# Altium project PCB_Project_CAN_DEV.PrjPcb
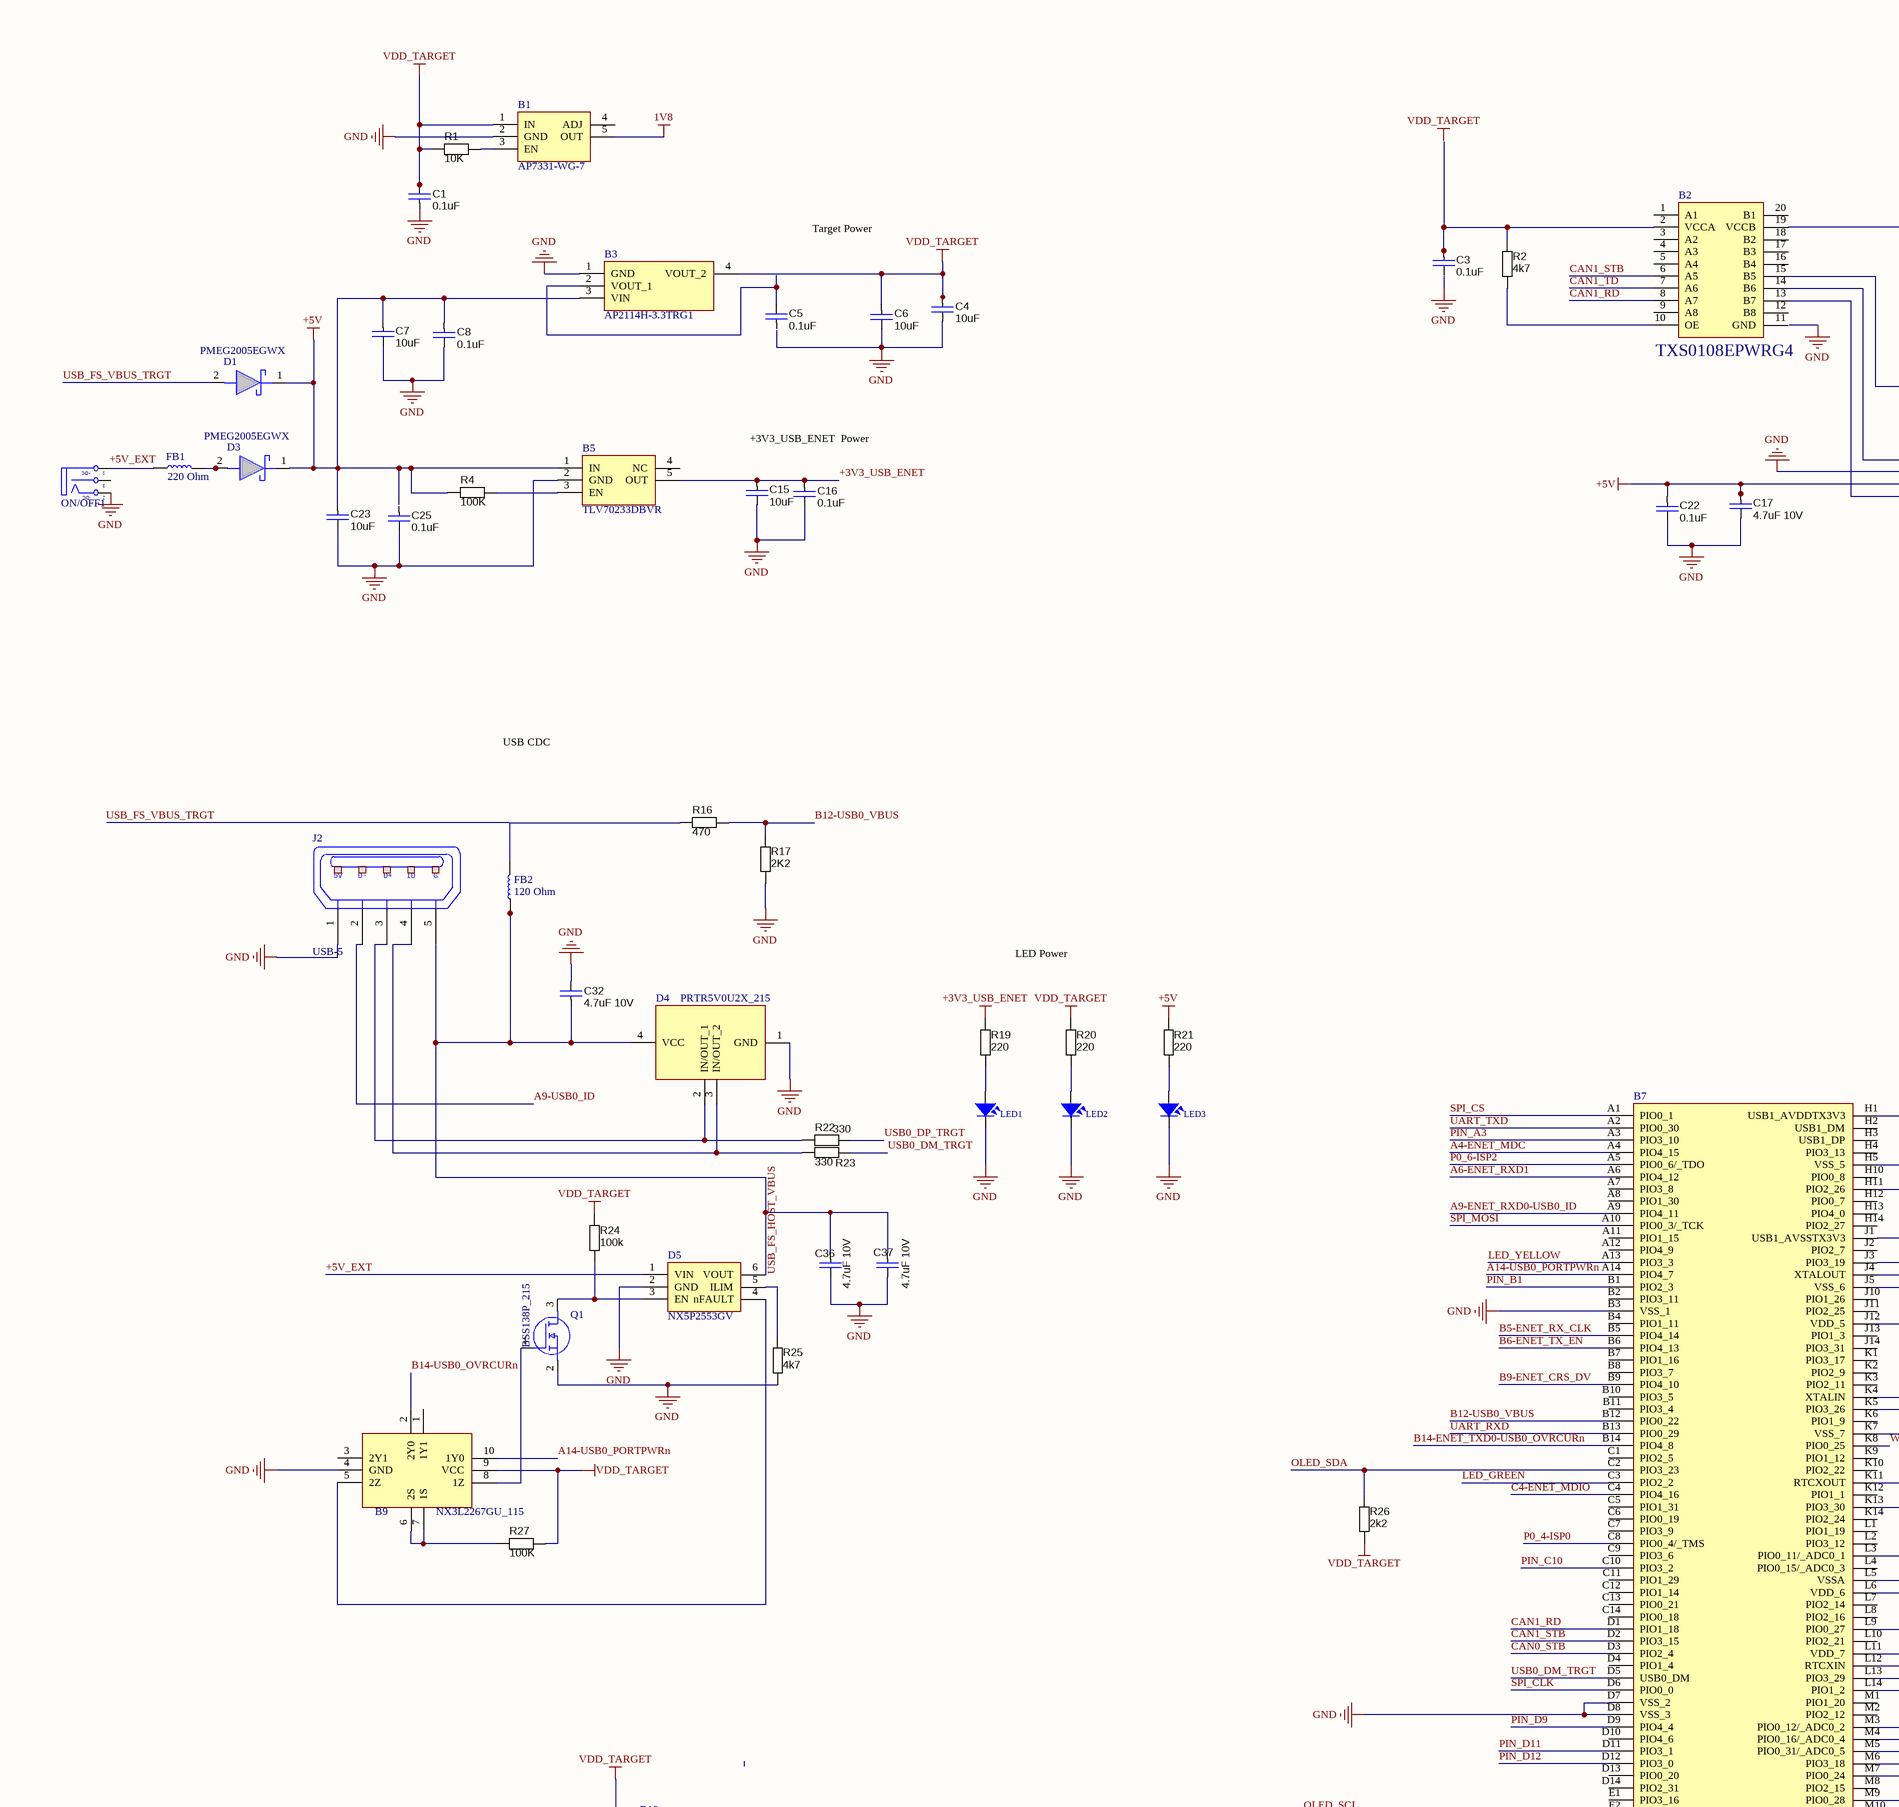
[diagram p0: CAN_DEVELOP.SchDoc, top left]
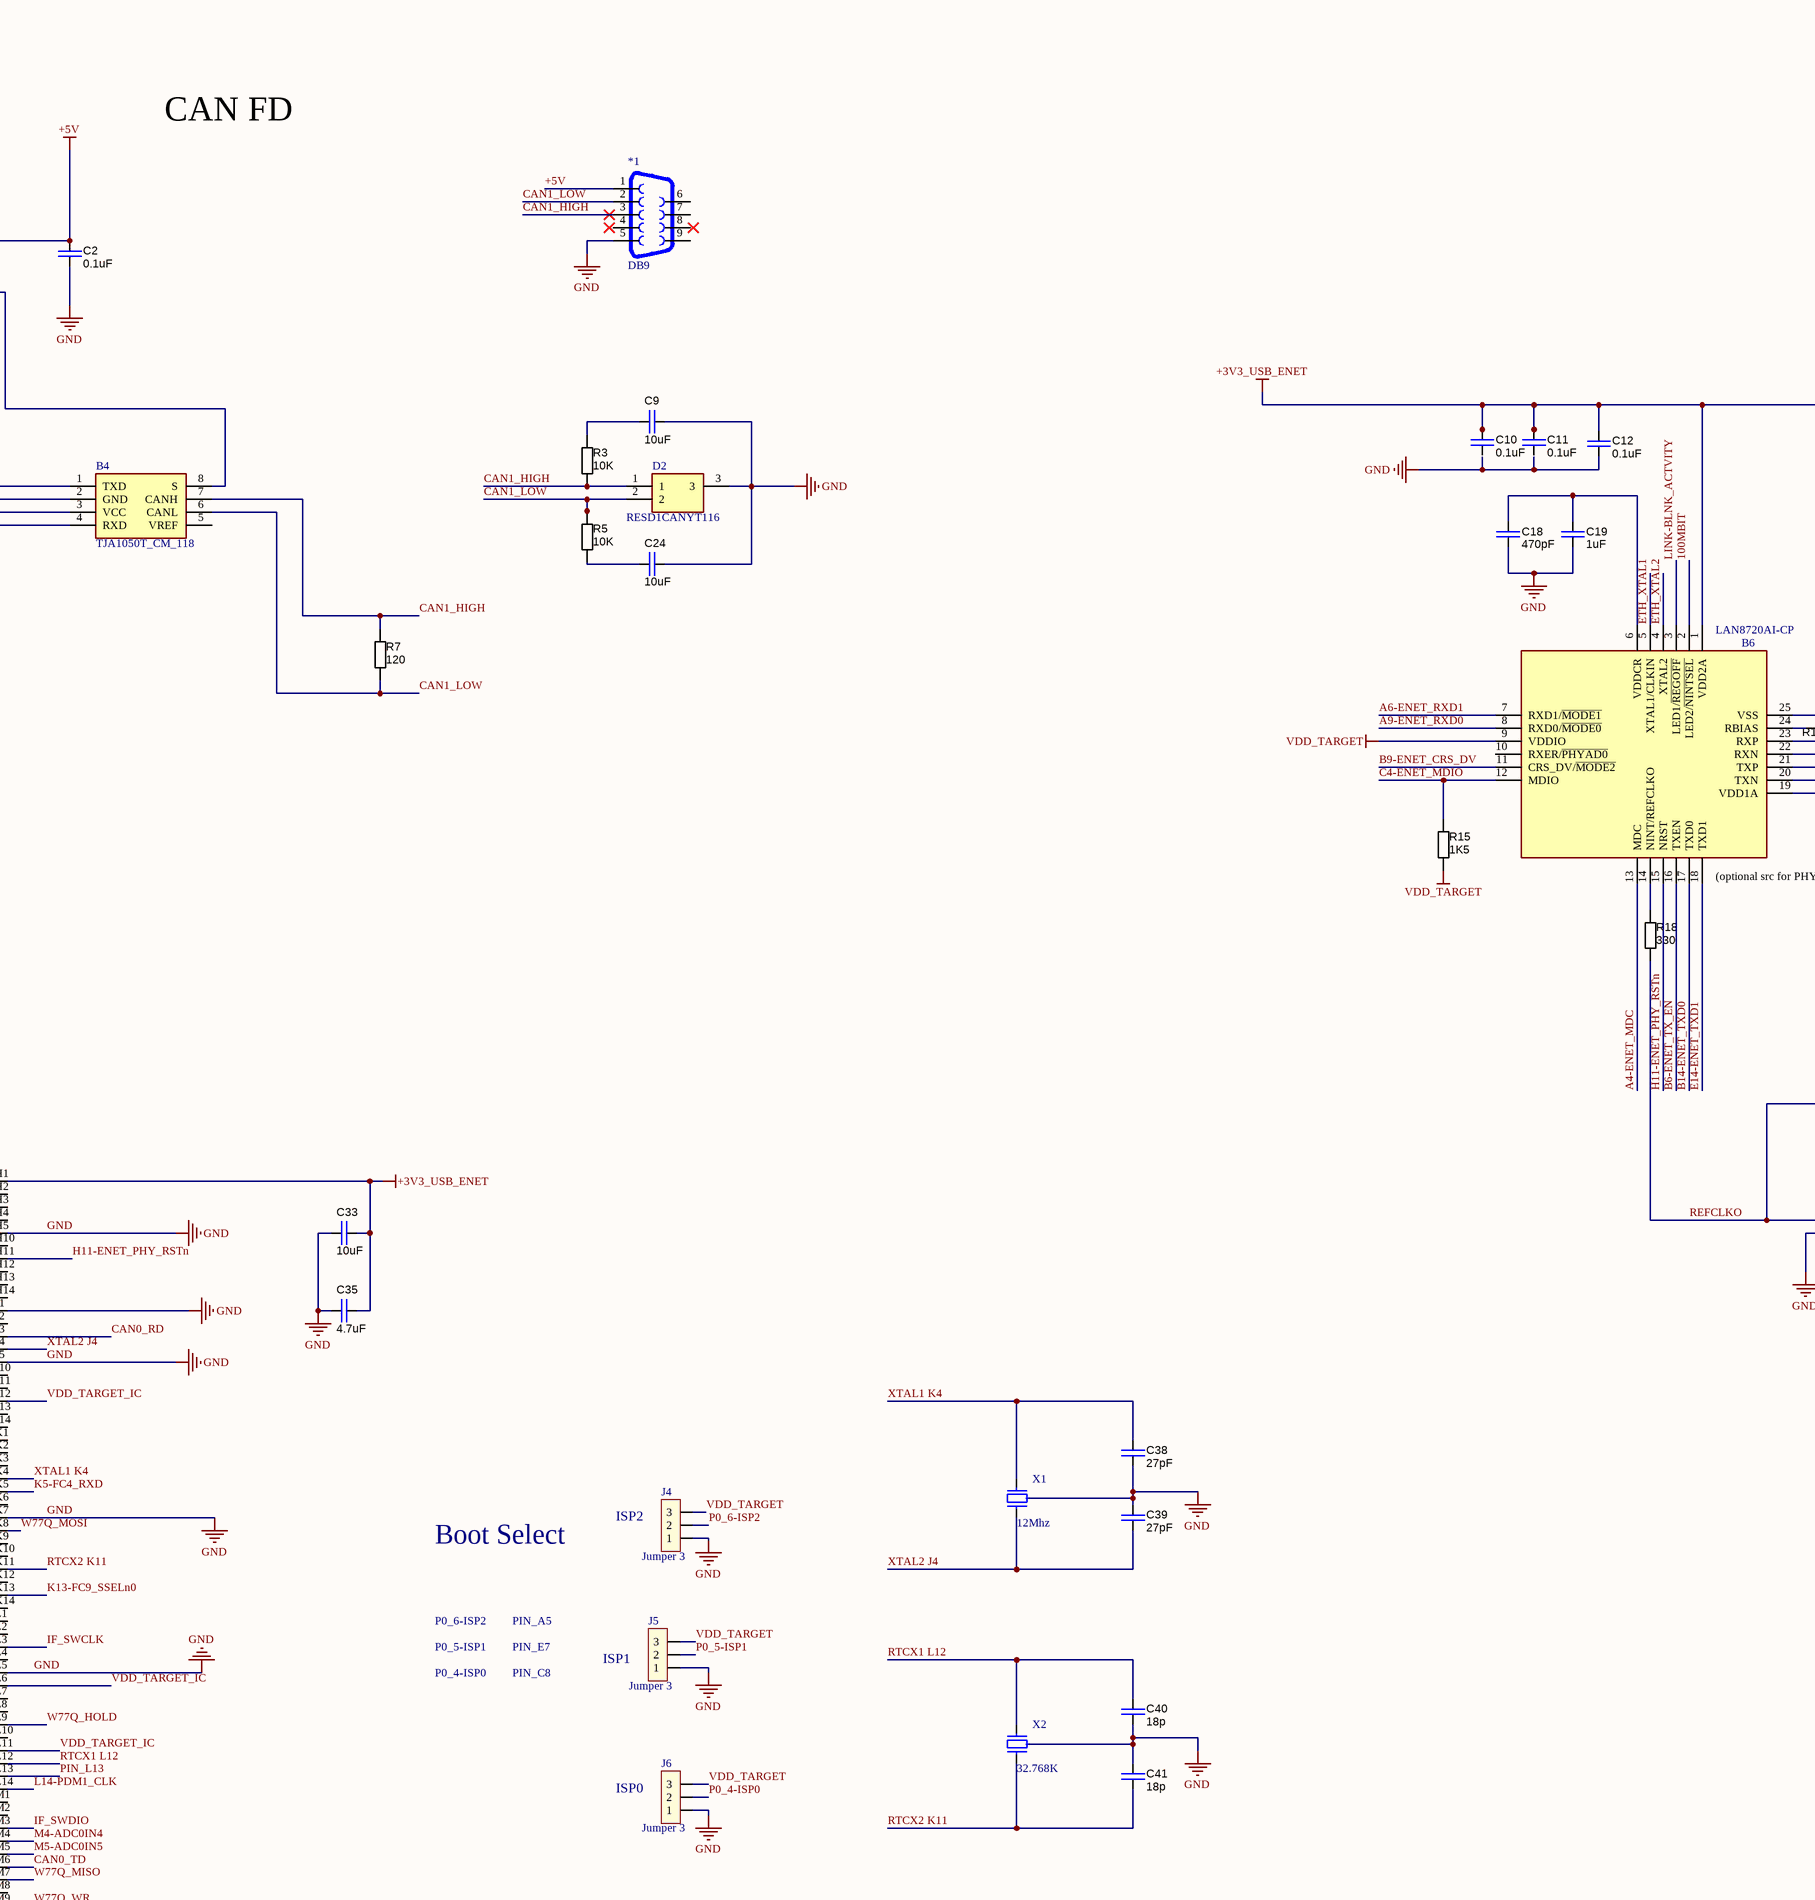
[diagram p1: CAN_DEVELOP.SchDoc, top middle]
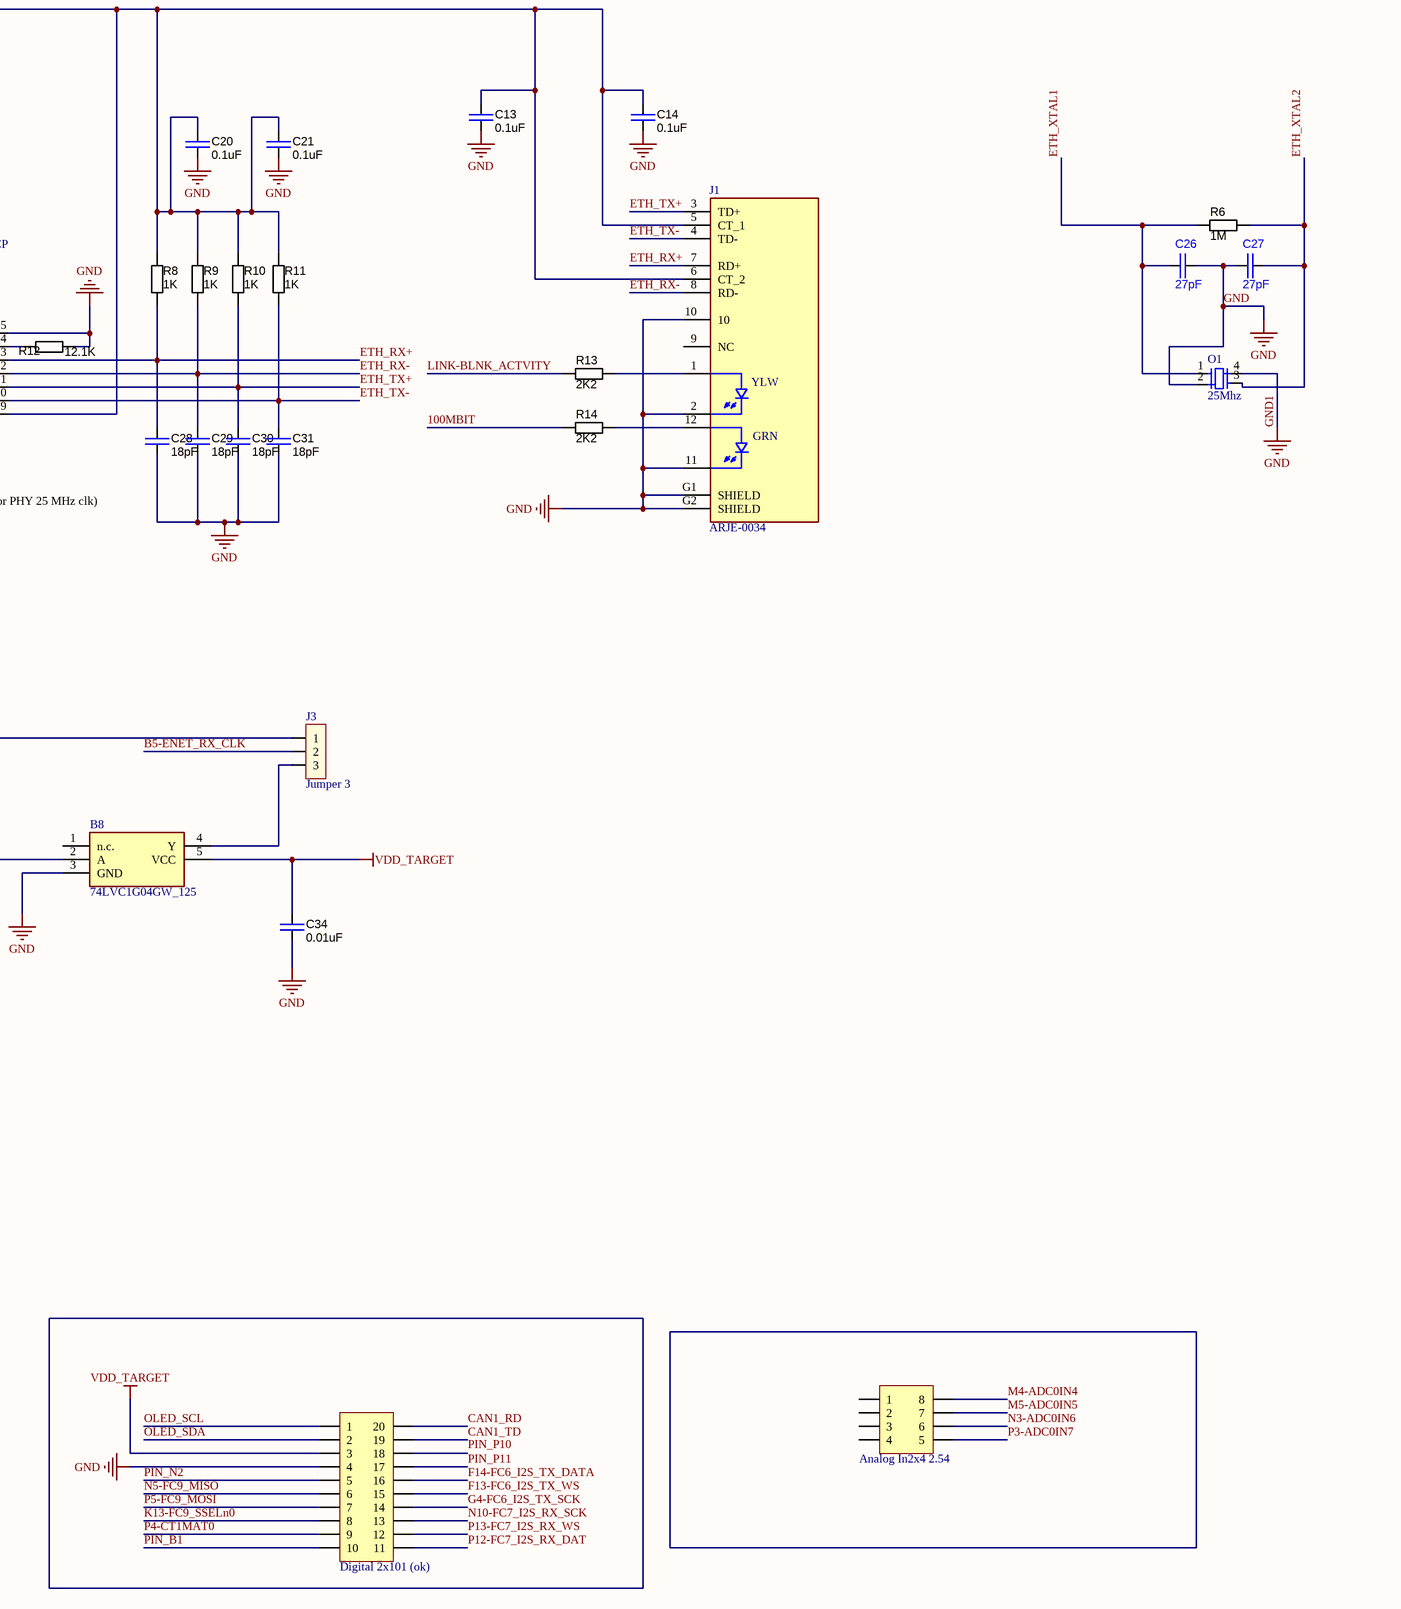
[diagram p2: CAN_DEVELOP.SchDoc, top right]
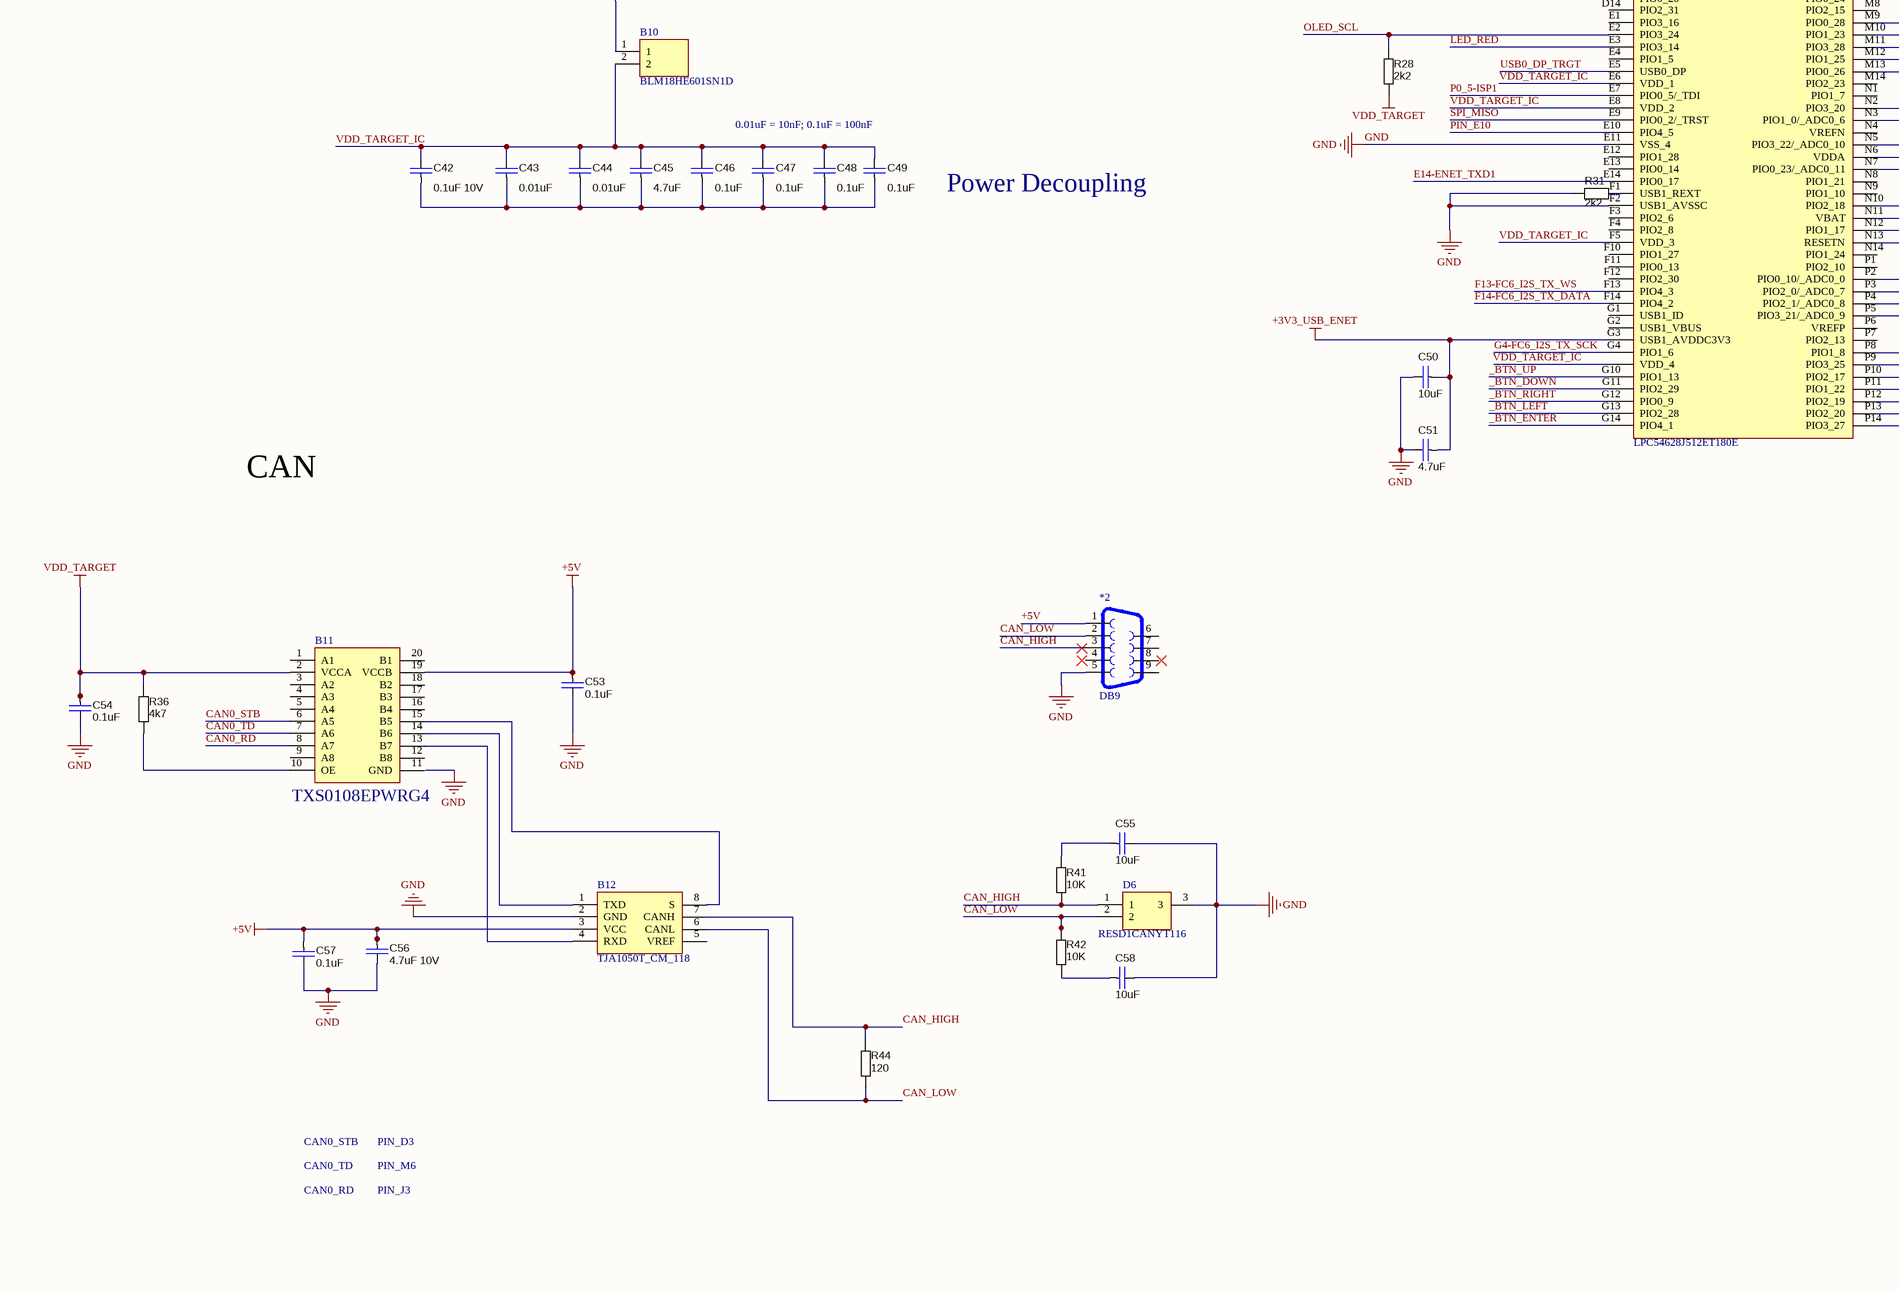
[diagram p3: CAN_DEVELOP.SchDoc, bottom left]
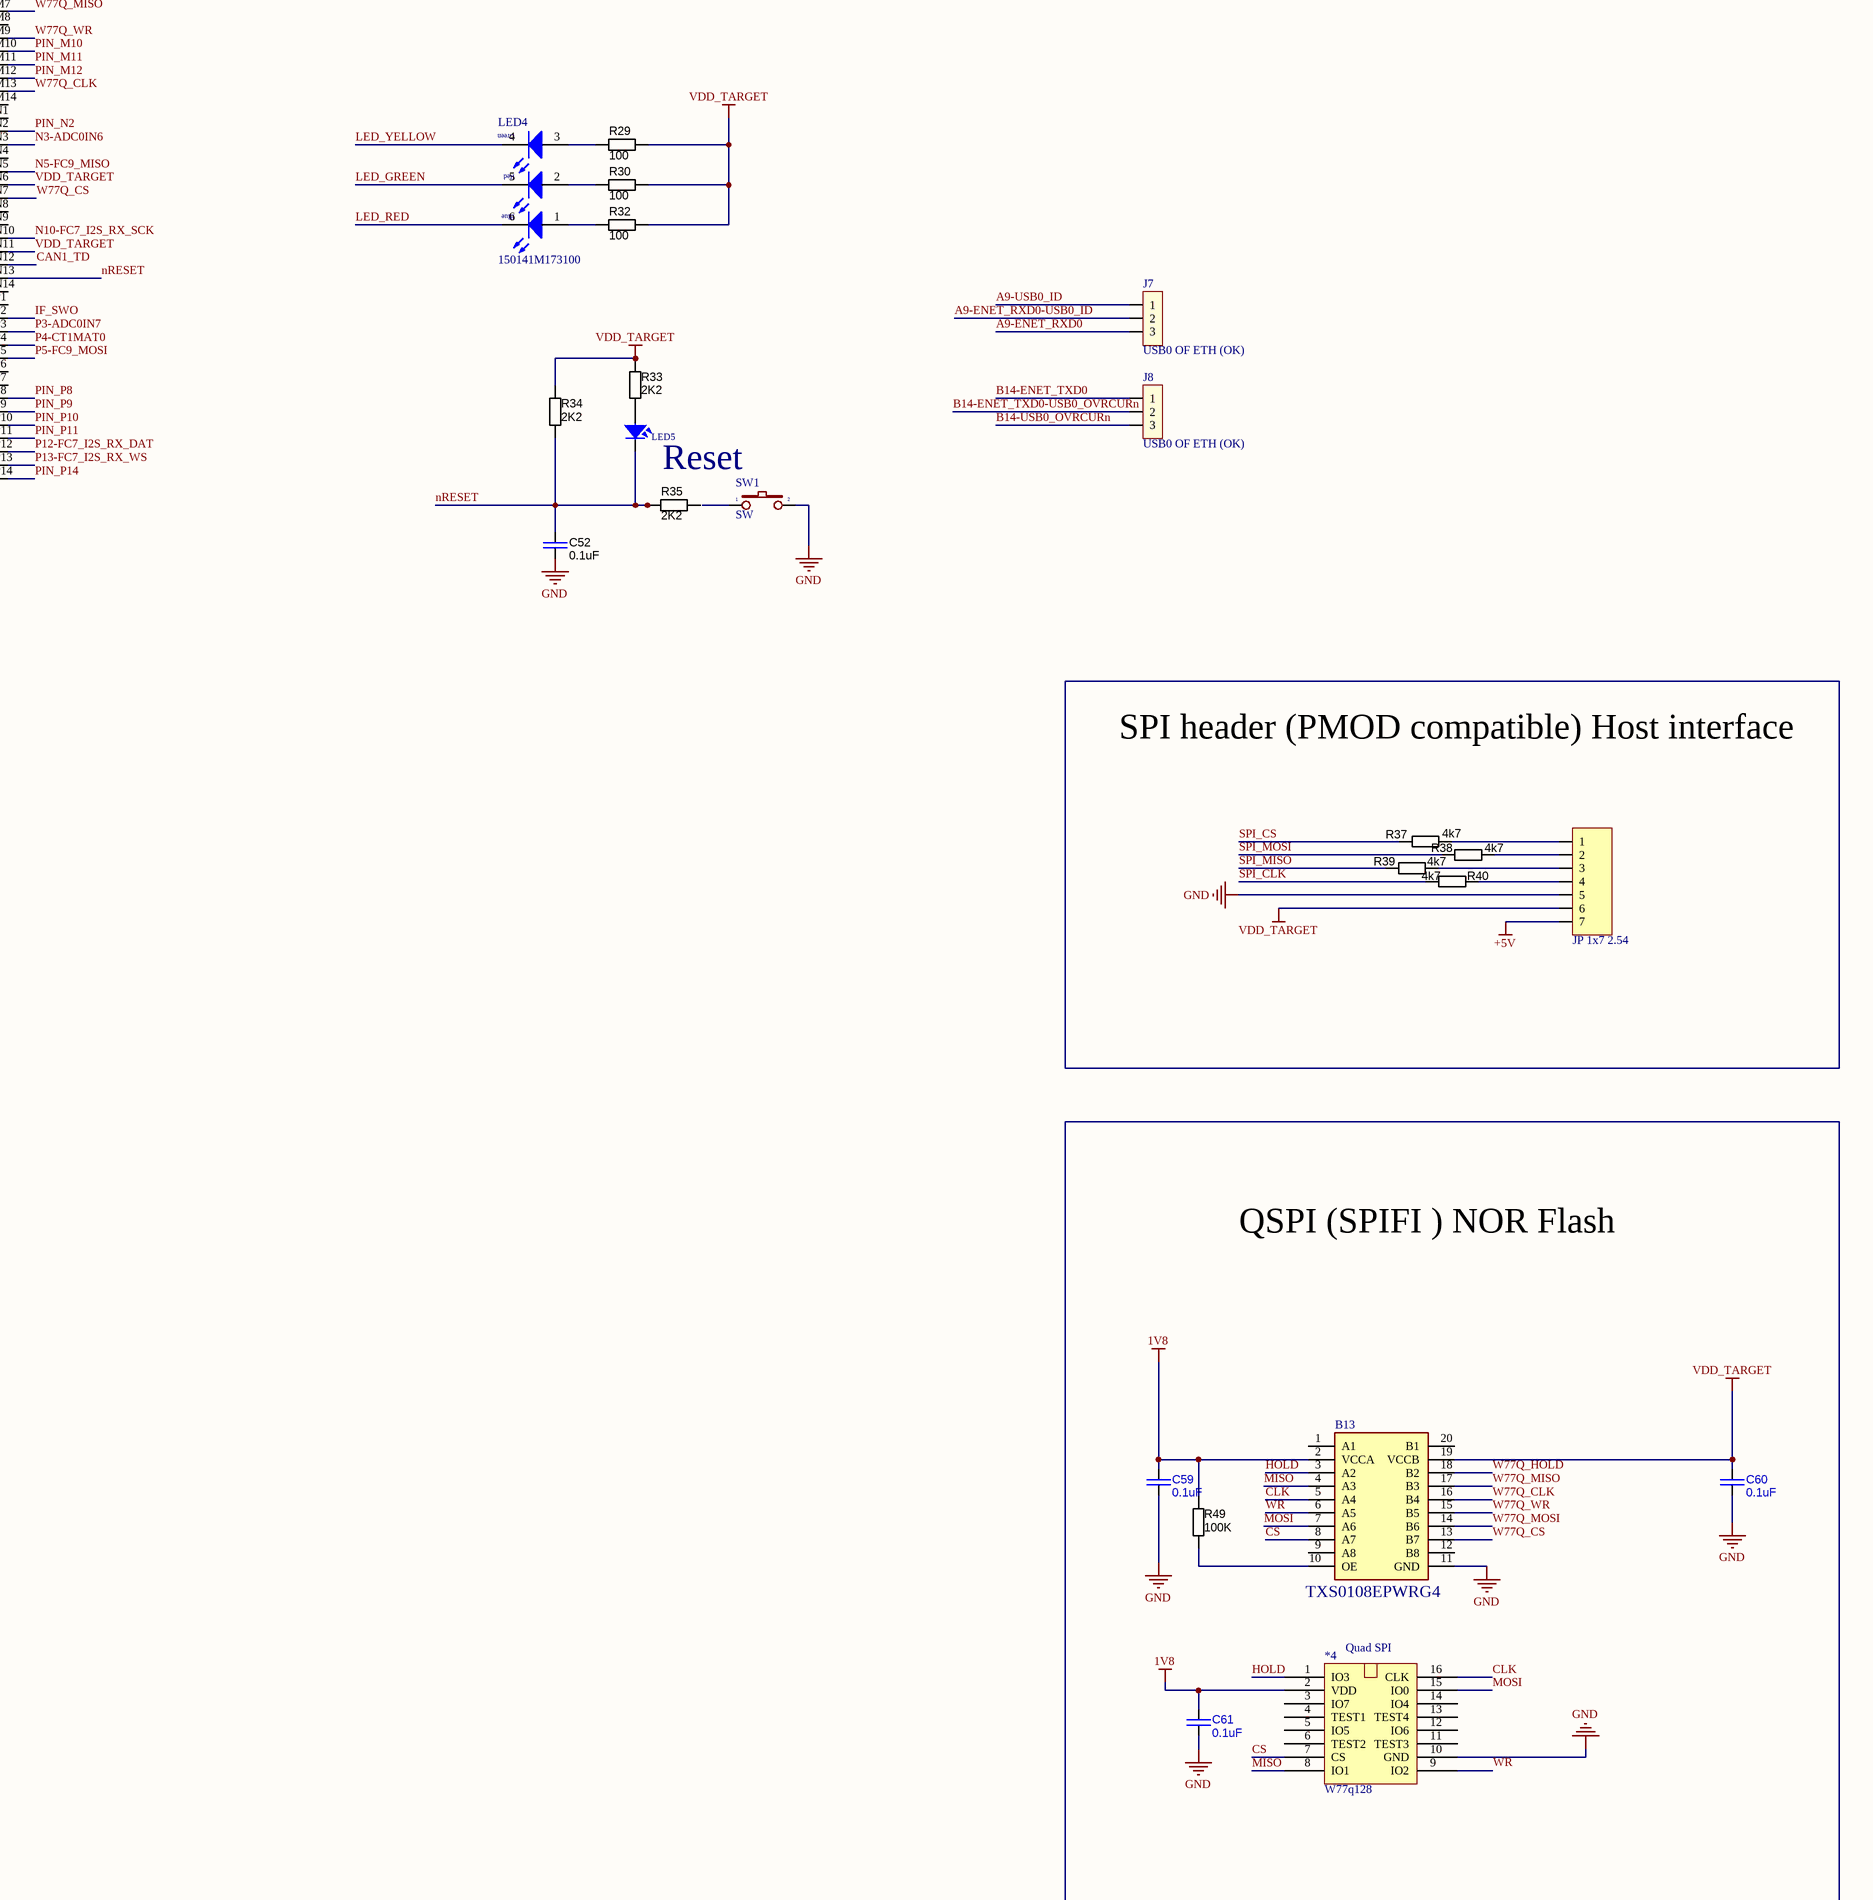
[diagram p4: CAN_DEVELOP.SchDoc, bottom middle]
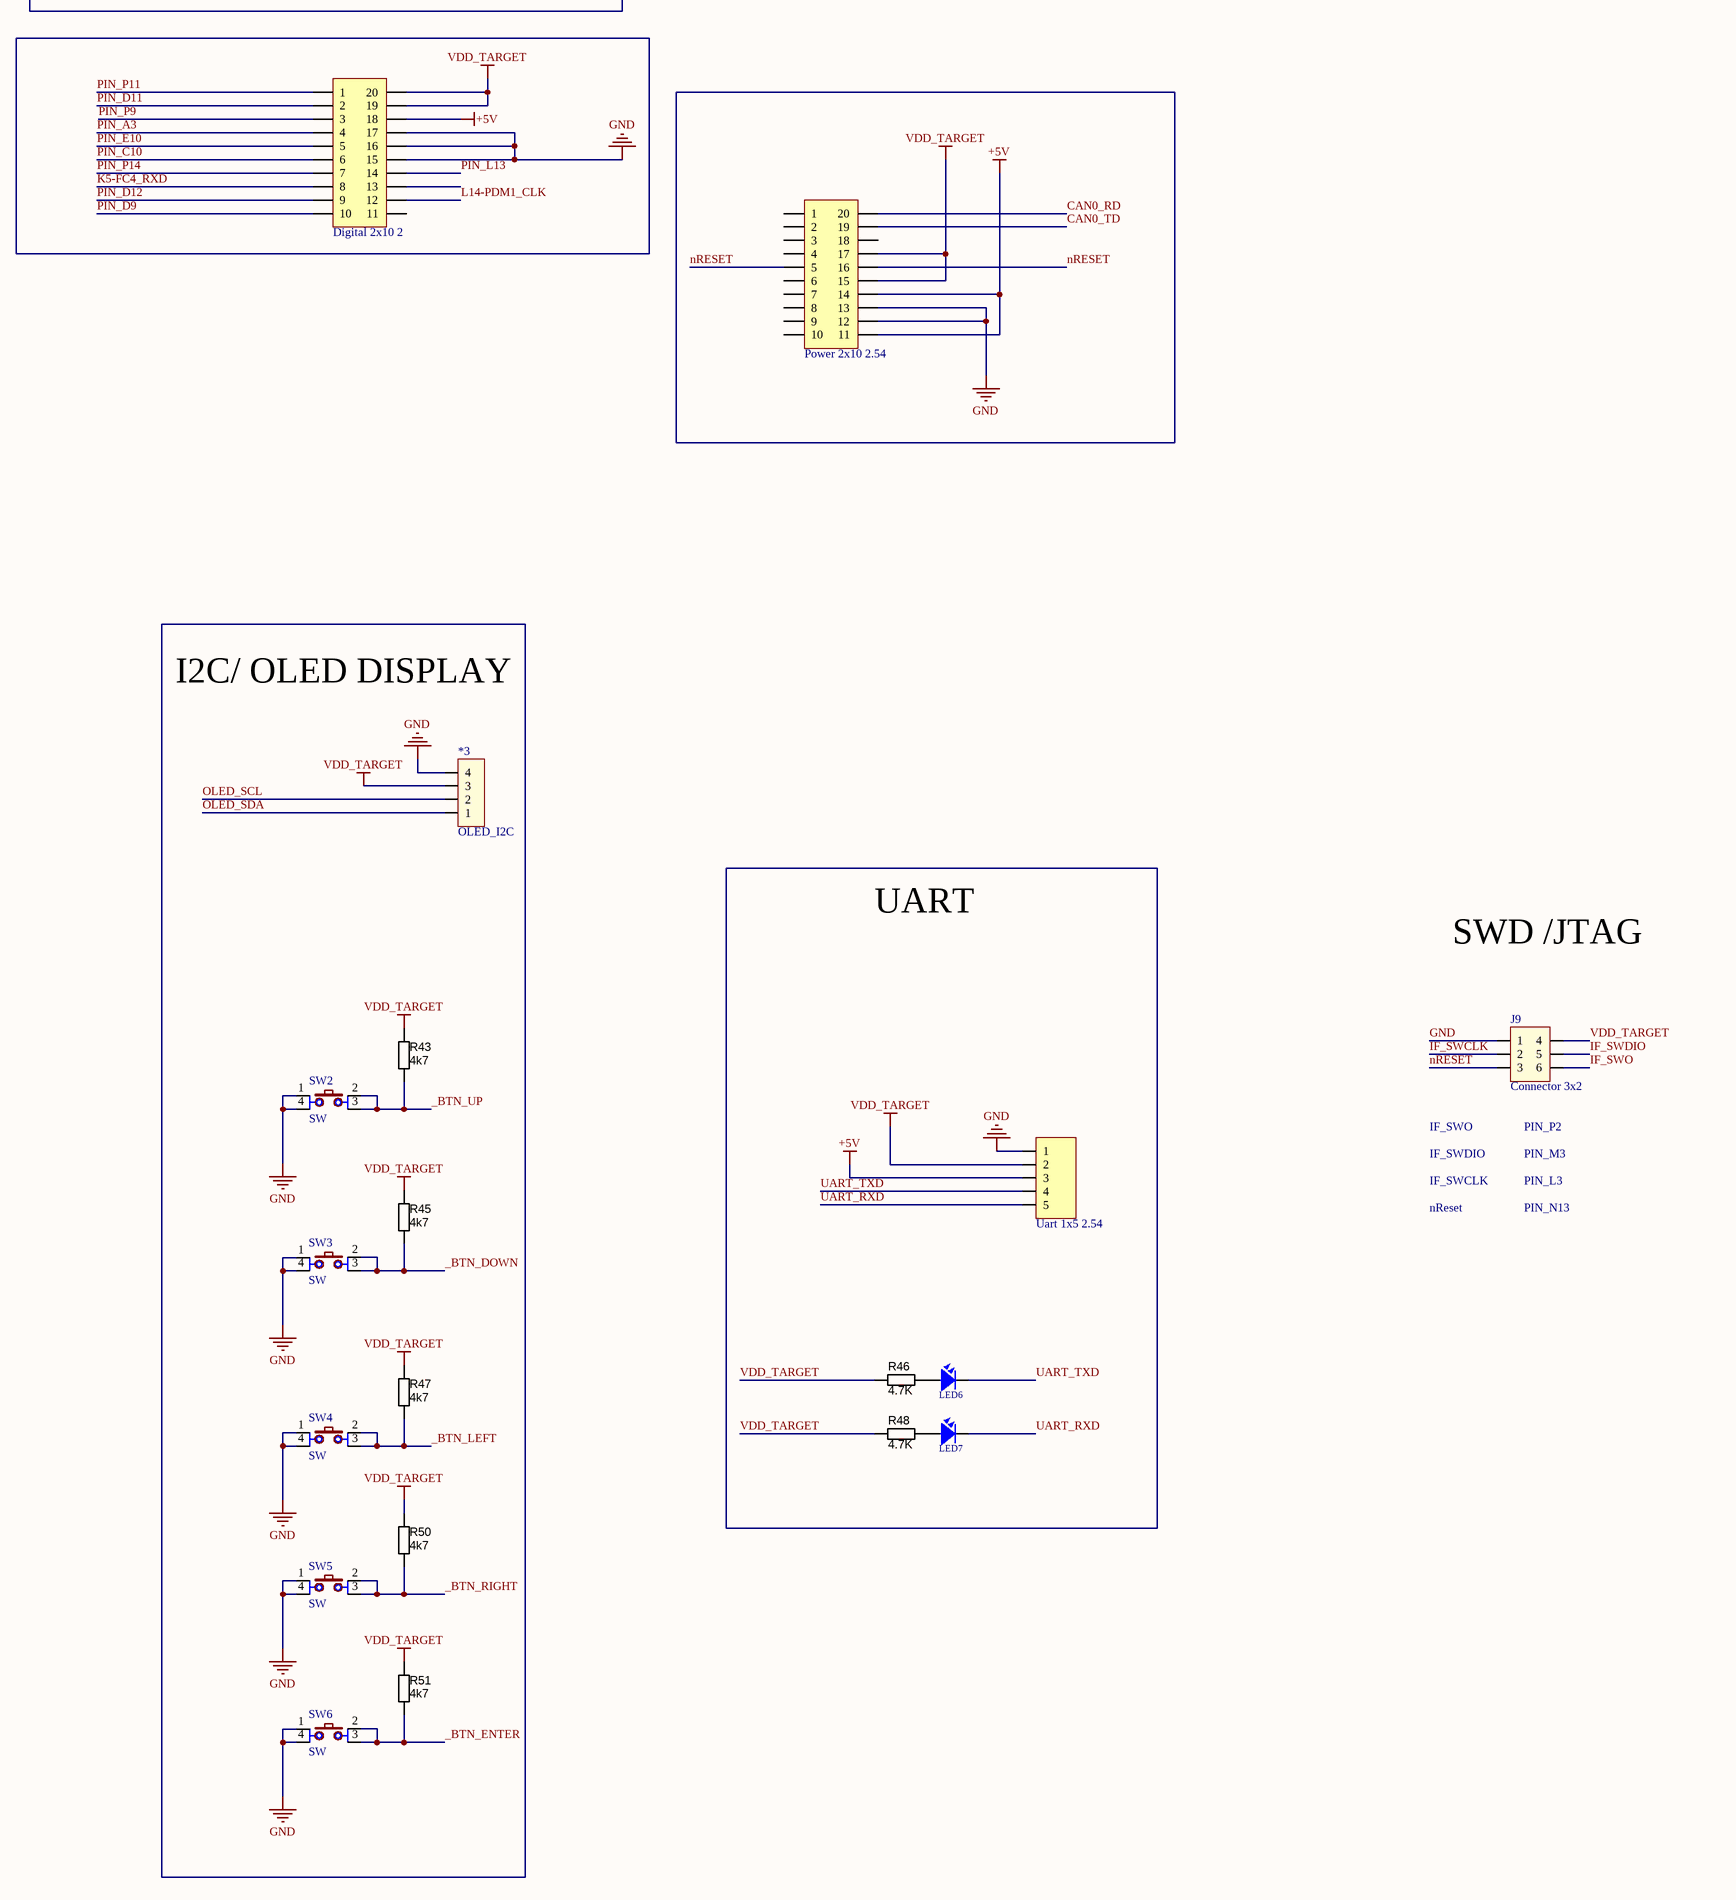
[diagram p5: CAN_DEVELOP.SchDoc, bottom right]
1 sheet, 170 parts. Net scope: global (net labels, ports and power ports of the same name join across sheets).
Board file: PCB2.PcbDoc

## Sheet CAN_DEVELOP.SchDoc
size A0; SheetNumber: 1; SheetTotal: 1

### Parts
*1  DB9  [DB9]
*2  DB9  [DB9]
*3  OLED_I2C  [OLED_I2C - duplicate]
*4  W77q128  [W77Q]
B1  AP7331-WG-7  [AP7331_WG]
B2  TXS0108EPWRG4  [TXS0108EPWRG4]
B3  AP2114H-3.3TRG1  [SOT230P700X180-4N]
B4  TJA1050T_CM_118  [TJA1050]
B5  TLV70233DBVR  [SOT95P280X145-5N]
B6  LAN8720AI-CP  [QFN50P400X400X100-25N-D]
B7  LPC54628J512ET180E  [BGA180C80P14X14_1200X1200X120]
B8  74LVC1G04GW_125  [SOT65P212X110-5N]
B9  NX3L2267GU_115  [QFN40P140X180X50-10N]
B10  BLM18HE601SN1D  [BLM18EG121SH1D]
B11  TXS0108EPWRG4  [TXS0108EPWRG4]
B12  TJA1050T_CM_118  [TJA1050]
B13  TXS0108EPWRG4  [TXS0108EPWRG4]
C1  0.1uF  [CAPC1608X90N]
C2  0.1uF  [CAPC1608X90N]
C3  0.1uF  [CAPC1608X90N]
C4  10uF  [CAPC1608X90N]
C5  0.1uF  [CAPC1608X90N]
C6  10uF  [CAPC1608X90N]
C7  10uF  [CAPC1608X90N]
C8  0.1uF  [CAPC1608X90N]
C9  10uF  [CAPC1608X90N]
C10  0.1uF  [CAPC1608X90N]
C11  0.1uF  [CAPC1608X90N]
C12  0.1uF  [CAPC1608X90N]
C13  0.1uF  [CAPC1608X90N]
C14  0.1uF  [CAPC1608X90N]
C15  10uF  [CAPC1608X90N]
C16  0.1uF  [CAPC1608X90N]
C17  4.7uF 10V  [CAPC1608X90N]
C18  470pF  [CAPC1608X90N]
C19  1uF  [CAPC1608X90N]
C20  0.1uF  [CAPC1608X90N]
C21  0.1uF  [CAPC1608X90N]
C22  0.1uF  [CAPC1608X90N]
C23  10uF  [CAPC1608X90N]
C24  10uF  [CAPC1608X90N]
C25  0.1uF  [CAPC1608X90N]
C26  value 27pF  [CAPC2012X135N]  (hidden comment: approved sub OK)
C27  value 27pF  [CAPC2012X135N]  (hidden comment: approved sub OK)
C28  18pF  [CAPC1608X90N]
C29  18pF  [CAPC1608X90N]
C30  18pF  [CAPC1608X90N]
C31  18pF  [CAPC1608X90N]
C32  4.7uF 10V  [CAPC1608X90N]
C33  10uF  [CAPC1608X90N]
C34  0.01uF  [CAPC1608X90N]
C35  4.7uF  [CAPC1608X90N]
C36  4.7uF 10V  [CAPC1608X90N]
C37  4.7uF 10V  [CAPC1608X90N]
C38  27pF  [CAPC1608X90N]
C39  27pF  [CAPC1608X90N]
C40  18p  [CAPC1608X90N]
C41  18p  [CAPC1608X90N]
C42  0.1uF 10V  [CAPC1608X90N]
C43  0.01uF  [CAPC1608X90N]
C44  0.01uF  [CAPC1608X90N]
C45  4.7uF  [CAPC1608X90N]
C46  0.1uF  [CAPC1608X90N]
C47  0.1uF  [CAPC1608X90N]
C48  0.1uF  [CAPC1608X90N]
C49  0.1uF  [CAPC1608X90N]
C50  10uF  [CAPC1608X90N]
C51  4.7uF  [CAPC1608X90N]
C52  0.1uF  [CAPC1608X90N]
C53  0.1uF  [CAPC1608X90N]
C54  0.1uF  [CAPC1608X90N]
C55  10uF  [CAPC1608X90N]
C56  4.7uF 10V  [CAPC1608X90N]
C57  0.1uF  [CAPC1608X90N]
C58  10uF  [CAPC1608X90N]
C59  0.1uF  [CAPC1005X55N]
C60  0.1uF  [CAPC1005X55N]
C61  0.1uF  [CAPC1005X55N]
D1  PMEG2005EGWX  [PMEG2005EGWX]
D2  RESD1CANYT116  [RESD1CANYT116]
D3  PMEG2005EGWX  [PMEG2005EGWX]
D4  PRTR5V0U2X_215  [PRTR5V0U2X]
D5  NX5P2553GV  [SOT95P250X110-6N]
D6  RESD1CANYT116  [RESD1CANYT116]
FB1  220 Ohm  [RES-0805]
FB2  120 Ohm  [RES-0805]
J1  ARJE-0034  [ARJE-0034]
J2  USB-5  [USB-M1]
J3  Jumper 3  [JP3]
J4  Jumper 3  [JP3]
J5  Jumper 3  [JP3]
J6  Jumper 3  [JP3]
J7  USB0 OF ETH (OK)  [JP3]
J8  USB0 OF ETH (OK)  [JP3]
J9  Connector 3x2  [JP3x2]
JP1  Analog In2x4 2.54  [JP 2X4 CC]
JP2  Digital 2x101 (ok)  [JP 2x10 CC]
JP3  Digital 2x10 2  [JP 2x10 CC]
JP4  Power 2x10 2.54  [JP 2x10 CC]
JP5  JP 1x7 2.54  [JP 1x7 CC]
JP6  Uart 1x5 2.54  [JP 1x5 CC]
LED1  LED SMD  [SM-LED-0805-Blue]  (value not drawn)
LED2  LED SMD  [SM-LED-0805-Blue]  (value not drawn)
LED3  LED SMD  [SM-LED-0805-Blue]  (value not drawn)
LED4  150141M173100  [LED RGB 5050]
LED5  LED SMD  [SM-LED-0805-Blue]  (value not drawn)
LED6  LED SMD  [SM-LED-0805-Blue]  (value not drawn)
LED7  LED SMD  [SM-LED-0805-Blue]  (value not drawn)
O1  25Mhz  [OSC SMD5070]
ON/OFF1  POWER  [DC-IN]  (value not drawn)
Q1  BSS138P_215  [SOT95P230X110-3N]
R1  value 10K  [RESC1608X55N]  (hidden comment: RES_NL_0603)  (no BOM)
R2  value 4k7  [RESC1608X55N]  (hidden comment: RES_NL_0603)  (no BOM)
R3  value 10K  [RESC1608X55N]  (hidden comment: RES_NL_0603)  (no BOM)
R4  value 100K  [RESC1608X55N]  (hidden comment: RES_NL_0603)  (no BOM)
R5  value 10K  [RESC1608X55N]  (hidden comment: RES_NL_0603)  (no BOM)
R6  value 1M  [RESC1005X40N]  (hidden comment: Thick Film)
R7  value 120  [RESC1608X55N]  (hidden comment: RES_NL_0603)  (no BOM)
R8  value 1K  [RESC1005X40N]  (hidden comment: Thick Film)
R9  value 1K  [RESC1005X40N]  (hidden comment: Thick Film)
R10  value 1K  [RESC1005X40N]  (hidden comment: Thick Film)
R11  value 1K  [RESC1005X40N]  (hidden comment: Thick Film)
R12  value 12.1K  [RESC1608X55N]  (hidden comment: RES_NL_0603)  (no BOM)
R13  value 2K2  [RESC1005X40N]  (hidden comment: Thick Film)
R14  value 2K2  [RESC1005X40N]  (hidden comment: Thick Film)
R15  value 1K5  [RESC1005X40N]  (hidden comment: Thick Film)
R16  value 470  [RESC1608X55N]  (hidden comment: RES_NL_0603)  (no BOM)
R17  value 2K2  [RESC1608X55N]  (hidden comment: RES_NL_0603)  (no BOM)
R18  value 330  [RESC1005X40N]  (hidden comment: Thick Film)
R19  value 220  [RESC1608X55N]  (hidden comment: RES_NL_0603)  (no BOM)
R20  value 220  [RESC1608X55N]  (hidden comment: RES_NL_0603)  (no BOM)
R21  value 220  [RESC1608X55N]  (hidden comment: RES_NL_0603)  (no BOM)
R22  value 330  [RESC1608X55N]  (hidden comment: RES_NL_0603)  (no BOM)
R23  value 330  [RESC1608X55N]  (hidden comment: RES_NL_0603)  (no BOM)
R24  value 100k  [RESC1608X55N]  (hidden comment: RES_NL_0603)  (no BOM)
R25  value 4k7  [RESC1608X55N]  (hidden comment: RES_NL_0603)  (no BOM)
R26  value 2k2  [RESC1005X40N]  (hidden comment: Thick Film)
R27  value 100K  [RESC1608X55N]  (hidden comment: RES_NL_0603)  (no BOM)
R28  value 2k2  [RESC1005X40N]  (hidden comment: Thick Film)
R29  value 100  [RESC1005X40N]  (hidden comment: Thick Film)
R30  value 100  [RESC1005X40N]  (hidden comment: Thick Film)
R31  value 2k2  [RESC1005X40N]  (hidden comment: Thick Film)
R32  value 100  [RESC1005X40N]  (hidden comment: Thick Film)
R33  value 2K2  [RESC1608X55N]  (hidden comment: RES_NL_0603)  (no BOM)
R34  value 2K2  [RESC1608X55N]  (hidden comment: RES_NL_0603)  (no BOM)
R35  value 2K2  [RESC1608X55N]  (hidden comment: RES_NL_0603)  (no BOM)
R36  value 4k7  [RESC1608X55N]  (hidden comment: RES_NL_0603)  (no BOM)
R37  value 4k7  [RESC1608X55N]  (hidden comment: RES_NL_0603)  (no BOM)
R38  value 4k7  [RESC1608X55N]  (hidden comment: RES_NL_0603)  (no BOM)
R39  value 4k7  [RESC1608X55N]  (hidden comment: RES_NL_0603)  (no BOM)
R40  value 4k7  [RESC1608X55N]  (hidden comment: RES_NL_0603)  (no BOM)
R41  value 10K  [RESC1608X55N]  (hidden comment: RES_NL_0603)  (no BOM)
R42  value 10K  [RESC1608X55N]  (hidden comment: RES_NL_0603)  (no BOM)
R43  value 4k7  [RESC1608X55N]  (hidden comment: RES_NL_0603)  (no BOM)
R44  value 120  [RESC1608X55N]  (hidden comment: RES_NL_0603)  (no BOM)
R45  value 4k7  [RESC1608X55N]  (hidden comment: RES_NL_0603)  (no BOM)
R46  value 4.7K  [RESC1005X40N]  (hidden comment: Thick Film)
R47  value 4k7  [RESC1608X55N]  (hidden comment: RES_NL_0603)  (no BOM)
R48  value 4.7K  [RESC1005X40N]  (hidden comment: Thick Film)
R49  value 100K  [RESC1608X55N]  (hidden comment: RES_NL_0603)  (no BOM)
R50  value 4k7  [RESC1608X55N]  (hidden comment: RES_NL_0603)  (no BOM)
R51  value 4k7  [RESC1608X55N]  (hidden comment: RES_NL_0603)  (no BOM)
SW1  SW  [SW1-SMD]
SW2  SW  [SW2-SMD]
SW3  SW  [SW2-SMD]
SW4  SW  [SW2-SMD]
SW5  SW  [SW2-SMD]
SW6  SW  [SW2-SMD]
X1  12Mhz  [XT3]
X2  32.768K  [XT3]

### Nets
1V8: *4.2(VDD) B1.5(OUT) B13.2(VCCA) C59.1 C61.1 R49.1
+3V3_USB_ENET: B5.5(OUT) B6.1(VDD2A) B6.19(VDD1A) B7.G3(USB1_AVDDC3V3) B7.H1(USB1_AVDDTX3V3) C10.1 C11.1 C12.1 C13.1 C14.1 C15.1 C16.1 C20.1 C21.1 C33.2 C35.2 C50.1 C51.1 J1.5(CT_1) J1.6(CT_2) R8.1 R9.1 R10.1 R11.1 R19.1
+5V: *1.1 *2.1 B2.19(VCCB) B3.3(VIN) B4.3(VCC) B5.1(IN) B11.19(VCCB) B12.3(VCC) C2.1 C7.1 C8.1 C17.1 C22.1 C23.1 C53.1 C56.1 C57.1 D1.1(K) D3.1(K) JP3.18 JP4.11 JP4.14 JP5.7 JP6.3 R4.1 R21.1
GND: *1.5 *2.5 *3.4 *4.10(GND) B1.2(GND) B3.1(GND) B4.2(GND) B5.2(GND) B6.25(VSS) B7.B3(VSS_1) B7.D7(VSS_2) B7.D8(VSS_3) B7.E11(VSS_4) B7.F2(USB1_AVSSC) B7.H5(VSS_5) B7.J1(USB1_AVSSTX3V3) B7.J5(VSS_6) B7.K7(VSS_7) B7.L5(VSSA) B8.3(GND) B9.4(GND) B12.2(GND) B13.11(GND) C1.1 C2.2 C7.2 C8.2 C9.2 C12.2 C13.2 C14.2 C15.2 C16.2 C17.2 C18.2 C19.2 C20.2 C21.2 C22.2 C23.2 C24.2 C25.2 C26.2 C27.1 C28.2 C29.2 C30.2 C31.2 C32.2 C33.1 C34.2 C35.1 C36.2 C37.2 C38.1 C39.1 C40.1 C41.2 C50.2 C51.2 C52.2 C53.2 C54.2 C55.2 C56.2 C57.2 C58.2 C59.2 C60.2 C61.2 D2.3 D4.1(GND) D5.2(GND) D6.3 J1.2 J1.10 J1.11 J1.G1(SHIELD) J1.G2(SHIELD) J2.1(P1) J4.1 J5.1 J6.1 J9.1 JP2.4 JP3.15 JP3.16 JP3.17 JP4.12 JP4.13 JP5.5 JP6.1 LED1.2 LED2.2 LED3.2 O1.2 O1.4 ON/OFF1.2(TN) Q1.2(S) R12.2 R17.2 R25.2 R31.1 SW1.2 SW2.1 SW2.4 SW3.1 SW3.4 SW4.1 SW4.4 SW5.1 SW5.4 SW6.1 SW6.4 X1.3 X2.3  [also labelled GND1]
VDD_TARGET: *3.3 B1.1(IN) B3.4(VOUT_2) B6.9(VDDIO) B7.N6(VDDA) B7.N11(VBAT) B8.5(VCC) B9.9(VCC) B10.1 B11.2(VCCA) B13.19(VCCB) C1.2 C4.1 C6.1 C34.1 C54.1 C60.1 J4.3 J5.3 J6.3 J9.4 JP2.3 JP3.19 JP3.20 JP4.15 JP4.17 JP5.6 JP6.2 R1.1 R15.2 R20.1 R24.1 R26.2 R27.2 R28.2 R29.2 R30.2 R32.2 R33.1 R34.1 R36.1 R43.1 R45.1 R46.1 R47.1 R48.1 R50.1 R51.1
100MBIT: B6.2(LED2/~{NINTSEL}) R14.1
+5V_EXT: D5.1(VIN)
_BTN_DOWN: B7.G11(PIO2_29) R45.2 SW3.2 SW3.3
_BTN_ENTER: B7.G14(PIO4_1) R51.2 SW6.2 SW6.3
_BTN_LEFT: B7.G13(PIO2_28) R47.2 SW4.2 SW4.3
_BTN_RIGHT: B7.G12(PIO0_9) R50.2 SW5.2 SW5.3
_BTN_UP: B7.G10(PIO1_13) R43.2 SW2.2 SW2.3
A4-ENET_MDC: B6.13(MDC) B7.A4(PIO4_15)
A6-ENET_RXD1: B6.7(RXD1/~{MODE1}) B7.A6(PIO4_12)
A9-ENET_RXD0: B6.8(RXD0/~{MODE0}) J7.3
A9-ENET_RXD0-USB0_ID: B7.A9(PIO4_11) J7.2
A9-USB0_ID: J2.2(P2) J7.1
A14-USB0_PORTPWRn: B7.A14(PIO4_7) B9.10(1Y0)
B5-ENET_RX_CLK: B7.B5(PIO4_14) J3.2
B6-ENET_TX_EN: B6.16(TXEN) B7.B6(PIO4_13)
B9-ENET_CRS_DV: B6.11(CRS_DV/~{MODE2}) B7.B9(PIO4_10)
B12-USB0_VBUS: B7.B12(PIO0_22) R16.2 R17.1
B14-ENET_TXD0: B6.17(TXD0) J8.1
B14-ENET_TXD0-USB0_OVRCURn: B7.B14(PIO4_8) J8.2
B14-USB0_OVRCURn: B9.2(2Y0) J8.3
C4-ENET_MDIO: B6.12(MDIO) B7.C4(PIO4_16) R15.1
CAN0_RD: B7.J3(PIO3_19) B11.8(A7) JP4.20
CAN0_STB: B7.D3(PIO2_4) B11.6(A5)
CAN0_TD: B7.M6(PIO3_18) B11.7(A6) JP4.19
CAN1_HIGH: *1.3 B4.7(CANH) D2.1 R3.2 R7.1
CAN1_LOW: *1.2 B4.6(CANL) D2.2 R5.1 R7.2
CAN1_RD: B2.8(A7) B7.D1(PIO1_18) JP2.20
CAN1_STB: B2.6(A5) B7.D2(PIO3_15)
CAN1_TD: B2.7(A6) B7.N12(PIO1_17) JP2.19
CAN_HIGH: *2.3 B12.7(CANH) D6.1 R41.2 R44.1
CAN_LOW: *2.2 B12.6(CANL) D6.2 R42.1 R44.2
CLK: *4.16(CLK) B13.5(A4)
CS: *4.7(CS) B13.8(A7)
E14-ENET_TXD1: B6.18(TXD1) B7.E14(PIO0_17)
ETH_RX+: B6.23(RXP) C28.1 J1.7(RD+) R8.2
ETH_RX-: B6.22(RXN) C29.1 J1.8(RD-) R9.2
ETH_TX+: B6.21(TXP) C30.1 J1.3(TD+) R10.2
ETH_TX-: B6.20(TXN) C31.1 J1.4(TD-) R11.2
ETH_XTAL1: B6.5(XTAL1/CLKIN) C26.1 O1.1(NC) R6.1
ETH_XTAL2: B6.4(XTAL2) C27.2 O1.3 R6.2
F13-FC6_I2S_TX_WS: B7.F13(PIO4_3) JP2.15
F14-FC6_I2S_TX_DATA: B7.F14(PIO4_2) JP2.16
G4-FC6_I2S_TX_SCK: B7.G4(PIO1_6) JP2.14
H11-ENET_PHY_RSTn: B6.15(NRST) B7.H11(PIO2_26)
HOLD: *4.1(IO3) B13.3(A2)
IF_SWCLK: B7.L3(PIO0_11/_ADC0_1) J9.2
IF_SWDIO: B7.M3(PIO0_12/_ADC0_2) J9.5
IF_SWO: B7.P2(PIO0_10/_ADC0_0) J9.6
K5-FC4_RXD: B7.K5(PIO3_26) JP3.8
K13-FC9_SSELn0: B7.K13(PIO3_30) JP2.8
L14-PDM1_CLK: B7.L14(PIO1_2) JP3.12
LED_GREEN: B7.C3(PIO2_2) LED4.5
LED_RED: B7.E3(PIO3_14) LED4.6
LED_YELLOW: B7.A13(PIO3_3) LED4.4
LINK-BLNK_ACTVITY: B6.3(LED1/~{REGOFF}) R13.1
M4-ADC0IN4: B7.M4(PIO0_16/_ADC0_4) JP1.8
M5-ADC0IN5: B7.M5(PIO0_31/_ADC0_5) JP1.7
MISO: *4.8(IO1) B13.4(A3)
MOSI: *4.15(IO0) B13.7(A6)
N3-ADC0IN6: B7.N3(PIO1_0/_ADC0_6) JP1.6
N5-FC9_MISO: B7.N5(PIO3_22/_ADC0_10) JP2.6
N10-FC7_I2S_RX_SCK: B7.N10(PIO2_18) JP2.13
nRESET: B7.N13(RESETN) C52.1 J9.3 JP4.5 JP4.16 LED5.2 R34.2 R35.1
OLED_SCL: *3.2 B7.E2(PIO3_24) JP2.1 R28.1
OLED_SDA: *3.1 B7.C2(PIO3_23) JP2.2 R26.1
P0_4-ISP0: B7.C8(PIO0_4/_TMS) J6.2
P0_5-ISP1: B7.E7(PIO0_5/_TDI) J5.2
P0_6-ISP2: B7.A5(PIO0_6/_TDO) J4.2
P3-ADC0IN7: B7.P3(PIO2_0/_ADC0_7) JP1.5
P4-CT1MAT0: B7.P4(PIO2_1/_ADC0_8) JP2.9
P5-FC9_MOSI: B7.P5(PIO3_21/_ADC0_9) JP2.7
P12-FC7_I2S_RX_DAT: B7.P12(PIO2_19) JP2.11
P13-FC7_I2S_RX_WS: B7.P13(PIO2_20) JP2.12
PIN_A3: B7.A3(PIO3_10) JP3.4
PIN_B1: B7.B1(PIO2_3) JP2.10
PIN_C10: B7.C10(PIO3_2) JP3.6
PIN_D9: B7.D9(PIO4_4) JP3.10
PIN_D11: B7.D11(PIO3_1) JP3.2
PIN_D12: B7.D12(PIO3_0) JP3.9
PIN_E10: B7.E10(PIO4_5) JP3.5
PIN_L13: B7.L13(PIO3_29) JP3.14
PIN_M10: B7.M10(PIO1_23)
PIN_M11: B7.M11(PIO3_28)
PIN_M12: B7.M12(PIO1_25)
PIN_N2: B7.N2(PIO3_20) JP2.5
PIN_P8: B7.P8(PIO1_8)
PIN_P9: B7.P9(PIO3_25) JP3.3
PIN_P10: B7.P10(PIO2_17)
PIN_P11: B7.P11(PIO1_22) JP2.17 JP3.1
PIN_P14: B7.P14(PIO3_27) JP3.7
REFCLKO: B8.2(A) J3.1 R18.2
RTCX1 L12: B7.L12(RTCXIN) C40.2 X2.2
RTCX2 K11: B7.K11(RTCXOUT) C41.1 X2.1
SPI_CLK: B7.D6(PIO0_0) R40.1
SPI_CS: B7.A1(PIO0_1) R37.1
SPI_MISO: B7.E9(PIO0_2/_TRST) R39.1
SPI_MOSI: B7.A10(PIO0_3/_TCK) R38.1
UART_RXD: B7.B13(PIO0_29) JP6.5 LED7.2
UART_TXD: B7.A2(PIO0_30) JP6.4 LED6.2
USB0_DM_TRGT: B7.D5(USB0_DM) R23.2
USB0_DP_TRGT: B7.E5(USB0_DP) R22.2
USB_FS_VBUS_TRGT: D1.2(A)
VDD_TARGET_IC: B7.E6(VDD_1) B7.E8(VDD_2) B7.F5(VDD_3) B7.J12(VDD_5) B7.L6(VDD_6) B7.L11(VDD_7) B10.2 C42.2 C43.2 C44.2 C45.2 C46.2 C47.2 C48.2 C49.2
W77Q_CLK: B7.M13(PIO0_26) B13.16(B4)
W77Q_CS: B7.N7(PIO0_23/_ADC0_11) B13.13(B7)
W77Q_HOLD: B7.L9(PIO0_27) B13.18(B2)
W77Q_MISO: B7.M7(PIO0_24) B13.17(B3)
W77Q_MOSI: B7.K8(PIO0_25) B13.14(B6)
W77Q_WR: B7.M9(PIO0_28) B13.15(B5)
WR: *4.9(IO2) B13.6(A5)
XTAL1 K4: B7.K4(XTALIN) C38.2 X1.2
XTAL2 J4: B7.J4(XTALOUT) C39.2 X1.1
NetB1_3: B1.3(EN) R1.2
NetB2_2: B2.2(VCCA) C3.1 R2.1
NetB2_10: B2.10(OE) R2.2
NetB2_13: B2.13(B7) B4.4(RXD)
NetB2_14: B2.14(B6) B4.1(TXD)
NetB2_15: B2.15(B5) B4.8(S)
NetB3_2: B3.2(VOUT_1) C5.2
NetB5_3: B5.3(EN) R4.2
NetB6_6: B6.6(VDDCR) C18.1 C19.1
NetB6_14: B6.14(NINT/REFCLKO) R18.1
NetB6_24: B6.24(RBIAS) R12.1
NetB7_F1: B7.F1(USB1_REXT) R31.2
NetB8_4: B8.4(Y) J3.3
NetB9_5: B9.5(2Z) D5.4(nFAULT)
NetB9_6: B9.6(2S) B9.7(1S) R27.1
NetB9_8: B9.8(1Z) Q1.1(G)
NetB11_10: B11.10(OE) R36.2
NetB11_13: B11.13(B7) B12.4(RXD)
NetB11_14: B11.14(B6) B12.1(TXD)
NetB11_15: B11.15(B5) B12.8(S)
NetB13_10: B13.10(OE) R49.2
NetC4_2: C4.2 C6.2
NetC9_1: C9.1 R3.1
NetC24_1: C24.1 R5.2
NetC32_1: C32.1 C36.1 C37.1 D4.4(VCC) D5.6(VOUT) FB2.1 J2.5(P5)
NetC42_1: C42.1 C43.1 C44.1 C45.1 C46.1 C47.1 C48.1 C49.1
NetC55_1: C55.1 R41.1
NetC58_1: C58.1 R42.2
NetD3_2: D3.2(A) FB1.2
NetD4_2: D4.2(IN/OUT_1) J2.3(P3) R22.1
NetD4_3: D4.3(IN/OUT_2) J2.4(P4) R23.1
NetD5_3: D5.3(EN) Q1.3(D) R24.2
NetD5_5: D5.5(ILIM) R25.1
NetFB1_1: FB1.1 ON/OFF1.1(T)
NetFB2_2: FB2.2 R16.1
NetJ1_1: J1.1 R13.2
NetJ1_12: J1.12 R14.2
NetJP5_1: JP5.1 R37.2
NetJP5_2: JP5.2 R38.2
NetJP5_3: JP5.3 R39.2
NetJP5_4: JP5.4 R40.2
NetLED1_1: LED1.1 R19.2
NetLED2_1: LED2.1 R20.2
NetLED3_1: LED3.1 R21.2
NetLED4_1: LED4.1 R32.1
NetLED4_2: LED4.2 R30.1
NetLED4_3: LED4.3 R29.1
NetLED5_1: LED5.1 R33.2
NetLED6_1: LED6.1 R46.2
NetLED7_1: LED7.1 R48.2

Not connected (* = marked no-connect by the designer): *1 4 6 7 8 9; *2 4 6 7 8 9; *4 3(IO7) 4(TEST1) 5(IO5) 6(TEST2) 11(TEST3) 12(IO6) 13(TEST4) 14(IO4); B1 4(ADJ); B2 1(A1) 3(A2) 4(A3) 5(A4) 9(A8) 11(GND) 12(B8) 16(B4) 17(B3) 18(B2) 20(B1); B4 5(VREF); B5 4(NC); B6 10(RXER/~{PHYAD0}); B7 ?1(VDD_4) A7(PIO3_8) A8(PIO1_30) A11(PIO1_15) A12(PIO4_9) B2(PIO3_11) B4(PIO1_11) B7(PIO1_16) B8(PIO3_7) B10(PIO3_5) B11(PIO3_4) C1(PIO2_5) C5(PIO1_31) C6(PIO0_19) C7(PIO3_9) C9(PIO3_6) C11(PIO1_29) C12(PIO1_14) C13(PIO0_21) C14(PIO0_18) D4(PIO1_4) D10(PIO4_6) D13(PIO0_20) D14(PIO2_31) E1(PIO3_16) E4(PIO1_5) E12(PIO1_28) E13(PIO0_14) F3(PIO2_6) F4(PIO2_8) F10(PIO1_27) F11(PIO0_13) F12(PIO2_30) G1(USB1_ID) G2(USB1_VBUS) H2(USB1_DM) H3(USB1_DP) H4(PIO3_13) H10(PIO0_8) H12(PIO0_7) H13(PIO4_0) H14(PIO2_27) J2(PIO2_7) J10(PIO1_26) J11(PIO2_25) J13(PIO1_3) J14(PIO3_31) K1(PIO3_17) K2(PIO2_9) K3(PIO2_11) K6(PIO1_9) K9(PIO1_12) K10(PIO2_22) K12(PIO1_1) K14(PIO2_24) L1(PIO1_19) L2(PIO3_12) L4(PIO0_15/_ADC0_3) L7(PIO2_14) L8(PIO2_16) L10(PIO2_21) M1(PIO1_20) M2(PIO2_12) M8(PIO2_15) M14(PIO2_23) N1(PIO1_7) N4(VREFN) N8(PIO1_21) N9(PIO1_10) N14(PIO1_24) P1(PIO2_10) P6(VREFP) P7(PIO2_13); B8 1(n.c.); B9 1(1Y1) 3(2Y1); B11 1(A1) 3(A2) 4(A3) 5(A4) 9(A8) 11(GND) 12(B8) 16(B4) 17(B3) 18(B2) 20(B1); B12 5(VREF); B13 1(A1) 9(A8) 12(B8) 20(B1); C3 2; C5 1; C10 2; C11 2; C25 1; J1 9(NC); JP1 1 2 3 4; JP2 18; JP3 11 13; JP4 1 2 3 4 6 7 8 9 10 18; ON/OFF1 3(S); R35 2; SW1 1

### Notes on the sheet
- CAN FD
- Target Power
- +3V3_USB_ENET  Power
- USB CDC
- (near B6) (optional src for PHY 25 MHz clk)
- LED Power
- (near J4) ISP2
- Boot Select
- P0_6-ISP2
- P0_5-ISP1
- PIN_A5
- PIN_E7
- P0_4-ISP0
- PIN_C8
- (near J5) ISP1
- (near J6) ISP0
- 0.01uF = 10nF; 0.1uF = 100nF
- Power Decoupling
- Reset
- CAN
- SPI header (PMOD compatible) Host interface
- I2C/ OLED DISPLAY
- UART
- SWD /JTAG
- IF_SWO
- IF_SWDIO
- PIN_P2
- PIN_M3
- QSPI (SPIFI ) NOR Flash
- IF_SWCLK
- nReset
- PIN_L3
- PIN_N13
- CAN0_STB
- CAN0_TD
- CAN0_RD
- PIN_D3
- PIN_M6
- PIN_J3
- (near *4) Quad SPI
- Labels drawn without touching a wire or pin: +5V_EXT, GND, PIN_P10, USB_FS_HOST_VBUS, USB_FS_VBUS_TRGT, VDD_TARGET, VDD_TARGET_IC
- (in symbol ARJE-0034) YLW; GRN
- (in symbol DCIN) +DC; -DC
- (in symbol LED RGB 5050) Green; Red; Blue
- (in symbol USB-5) 5V; D-; D+; ID; G

### Library data of the parts
B1 = AP7331-WG-7: LDO Voltage Regulators LDO SOT-25 ADJUSTABLE 300MA; Manufacturer_Name: Diodes Inc.; Geometry.Height: 1.45mm; Mouser Part Number: 621-AP7331-WG-7; Mouser Price/Stock: https://www.mouser.co.uk/ProductDetail/Diodes-Incorporated/AP7331-WG-7?qs=vIZ3oKQCLxr9PiNSCoXN%2FQ%3D%3D; Manufacturer_Part_Number: AP7331-WG-7; Datasheet Link: *
B2 B11 B13 = TXS0108EPWRG4: Translation - Voltage Levels 8B Bidir Vltg-Level Translator; Manufacturer_Name: Texas Instruments; Geometry.Height: 1.2mm; Mouser Part Number: 595-TXS0108EPWRG4; Mouser Price/Stock: https://www.mouser.co.uk/ProductDetail/Texas-Instruments/TXS0108EPWRG4?qs=wkx8pu8tL7LKCwSiM1j4%252Bw%3D%3D; Manufacturer_Part_Number: TXS0108EPWRG4; Datasheet Link: https://www.ti.com/lit/ds/symlink/txs0108e.pdf?ts=1617786399489&ref_url=https%253A%252F%252Fyellow-search.com%252F
B3 = AP2114H-3.3TRG1: 1A 3.3V Low Noise LDO Regulator SOT223 DiodesZetex AP2114H-3.3TRG1, LDO Voltage Regulator, 1 (Min)A, 3.3 V +/-1.5%, 2.5  6 Vin, 3-Pin SOT-223; Manufacturer_Name: Diodes Inc.; Geometry.Height: 1.8mm; Mouser Part Number: 621-AP2114H-3.3TRG1; Mouser Price/Stock: https://www.mouser.co.uk/ProductDetail/Diodes-Incorporated/AP2114H-3.3TRG1?qs=x6A8l6qLYDDSG%2FfwzcsOhw%3D%3D; Manufacturer_Part_Number: AP2114H-3.3TRG1; Datasheet Link: *
B4 B12 = TJA1050T_CM_118: NXP - TJA1050T/CM,118 - CAN TRANSCEIVER, 1TX/RX, SOIC-8; Geometry.Height: 1.75mm; Mouser Part Number: 771-TJA1050T/CM118; Mouser Price/Stock: https://www.mouser.co.uk/ProductDetail/NXP-Semiconductors/TJA1050T-CM118?qs=5XOdhvmYM0NFFspw0VP5sA%3D%3D; Manufacturer_Name: NXP; Manufacturer_Part_Number: TJA1050T/CM,118; Datasheet Link: http://www.nxp.com/docs/en/data-sheet/TJA1050.pdf
B5 = TLV70233DBVR: 300mA Low-Iq Low-Dropout (LDO) Regulator for Portables; Manufacturer_Name: Texas Instruments; Geometry.Height: 1.45mm; Mouser Part Number: 595-TLV70233DBVR; Mouser Price/Stock: https://www.mouser.co.uk/ProductDetail/Texas-Instruments/TLV70233DBVR?qs=zQ2yIHQ6k3wiHrD0NUI05Q%3D%3D; Manufacturer_Part_Number: TLV70233DBVR; Datasheet Link: http://www.ti.com/lit/gpn/tlv702
B6 = LAN8720AI-CP: Low Power RMII 10/100 Ethernet PHY QFN24 Microchip LAN8720AI-CP Ethernet Transceiver, IEEE 802.3u, 10 Mbps, 100 Mbps 3.3 V, 24-Pin QFN; Geometry.Height: 1mm; Mouser Part Number: 886-LAN8720AI-CP; Mouser Price/Stock: https://www.mouser.co.uk/ProductDetail/Microchip-Technology/LAN8720AI-CP?qs=pA5MXup5wxGFjbujD0Lq5A%3D%3D; Manufacturer_Name: Microchip; Manufacturer_Part_Number: LAN8720AI-CP; Datasheet Link: https://datasheet.datasheetarchive.com/originals/distributors/Datasheets_SAMA/b5839e599958d8271adf7b0005a7ec5a.pdf
B7 = LPC54628J512ET180E: NXP - LPC54628J512ET180E - ARM MCU, 145, LPC Family LPC54000 Series Microcontrollers, ARM Cortex-M4, 32bit, 220 MHz, 512 KB; Geometry.Height: 1.2mm; Mouser Part Number: 771-LPC54628512ET180; Mouser Price/Stock: https://www.mouser.co.uk/ProductDetail/NXP-Semiconductors/LPC54628J512ET180E?qs=HXFqYaX1Q2wGa7jURbjAiQ%3D%3D; Manufacturer_Name: NXP; Manufacturer_Part_Number: LPC54628J512ET180E; Datasheet Link: http://www.nxp.com/docs/en/data-sheet/LPC546XX.pdf
B8 = 74LVC1G04GW_125: Nexperia 74LVC1G04GW,125 Inverter, 5-Pin TSSOP; Geometry.Height: 1.1mm; Mouser Part Number: 771-74LVC1G04GW-G; Mouser Price/Stock: https://www.mouser.co.uk/ProductDetail/Nexperia/74LVC1G04GW125?qs=me8TqzrmIYXDN0WZ7xTSuQ%3D%3D; Manufacturer_Name: Nexperia; Manufacturer_Part_Number: 74LVC1G04GW,125; Datasheet Link: https://assets.nexperia.com/documents/data-sheet/74LVC1G04.pdf
B9 = NX3L2267GU_115: 2 Circuit IC Switch 2:1 750mOhm 10-XQFN (1.4x1.8); Manufacturer_Name: NXP; Manufacturer_Part_Number: NX3L2267GU,115; Geometry.Height: 0.5mm; Mouser Part Number: 771-NX3L2267GU115; Mouser Price/Stock: https://www.mouser.co.uk/ProductDetail/NXP-Semiconductors/NX3L2267GU115?qs=A1cBxND5mHJo%252BvgrLdXrcQ%3D%3D; Datasheet Link: http://www.nxp.com/docs/en/data-sheet/NX3L2267.pdf
B10 = BLM18HE601SN1D: BLM18_N1D Series EMI Suppression Filter 600+/-25% at 100MHz 800mA @85; Manufacturer_Name: Murata Electronics; Geometry.Height: 0.95mm; Mouser Part Number: 81-BLM18HE601SN1D; Mouser Price/Stock: https://www.mouser.co.uk/ProductDetail/Murata-Electronics/BLM18HE601SN1D?qs=%2F%252BYoplLUB5hymM76VL7Sqw%3D%3D; Manufacturer_Part_Number: BLM18HE601SN1D; Datasheet Link: http://www.murata.com/~/media/webrenewal/support/library/catalog/products/emc/emifil/c31e.ashx?la=en-gb
C1 C4-C8 C10-C21 C23 C25 C28-C52 C56 = CAP C_0603: Capacitor SMD Cer 470nF 10% 16V X7R 0603; Manufacturer 1: Murata Electronics North America; Manufacturer Part Number 1: GRM188R71C474KA88D; Ratings: 16V; X7R; Material: ceramic; SCDType: spec; Package / Case: 0603 (1608 metric); Tolerance: ±10%; Manufacturer 2: TDK Corporation; Manufacturer Part Number 2: C1608X7R1C474K; Supplier 1: Digi-Key; Supplier Part Number 1: 490-3295-2-ND; Supplier 2: Digi-Key; Supplier Part Number 2: 445-5192-2-ND; Supplier 3: Digi-Key; Supplier Part Number 3: 587-1250-2-ND; Manufacturer 3: Taiyo Yuden; Manufacturer Part Number 3: EMK107B7474KA-T; Manufacturer 4: Samsung; Manufacturer Part Number 4: CL10B474KONE; ComponentLink1URL: http://psearch.murata.com/capacitor/product/GRM188R71C474KA88#.pdf; ComponentLink1Description: http://psearch.murata.com/capacitor/product/GRM188R71C474KA88#.pdf; ComponentLink2URL: http://product.tdk.com/capacitor/mlcc/en/documents/mlcc_commercial_general_en.pdf; ComponentLink2Description: http://product.tdk.com/capacitor/mlcc/en/documents/mlcc_commercial_general_en.pdf; ComponentLink3URL: http://www.yuden.co.jp/or/product/category/capacitor/EMK107B7474KA-T.pdf; ComponentLink3Description: http://www.yuden.co.jp/or/product/category/capacitor/EMK107B7474KA-T.pdf
  C1 C5 C8 C10-C14 C16 C20 C21 C25 C46-C49 C52: Value: 0.1uF
  C4 C6 C7 C15 C23 C33 C50: Value: 10uF
  C17 C32 C36 C37 C56: Value: 4.7uF 10V
  C18: Value: 470pF
  C19: Value: 1uF
  C28-C31: Value: 18pF
  C34 C43 C44: Value: 0.01uF
  C35 C45 C51: Value: 4.7uF
  C38 C39: Value: 27pF
  C40 C41: Value: 18p
  C42: Value: 0.1uF 10V
C2 C3 C9 C22 C24 C53-C55 C57 C58 = CAP C_0603_1: Capacitor SMD Cer 470nF 10% 16V X7R 0603; Manufacturer 1: Murata Electronics North America; Manufacturer Part Number 1: GRM188R71C474KA88D; Ratings: 16V; X7R; Material: ceramic; SCDType: spec; Package / Case: 0603 (1608 metric); Tolerance: ±10%; Manufacturer 2: TDK Corporation; Manufacturer Part Number 2: C1608X7R1C474K; Supplier 1: Digi-Key; Supplier Part Number 1: 490-3295-2-ND; Supplier 2: Digi-Key; Supplier Part Number 2: 445-5192-2-ND; Supplier 3: Digi-Key; Supplier Part Number 3: 587-1250-2-ND; Manufacturer 3: Taiyo Yuden; Manufacturer Part Number 3: EMK107B7474KA-T; Manufacturer 4: Samsung; Manufacturer Part Number 4: CL10B474KONE; ComponentLink1URL: http://psearch.murata.com/capacitor/product/GRM188R71C474KA88#.pdf; ComponentLink1Description: http://psearch.murata.com/capacitor/product/GRM188R71C474KA88#.pdf; ComponentLink2URL: http://product.tdk.com/capacitor/mlcc/en/documents/mlcc_commercial_general_en.pdf; ComponentLink2Description: http://product.tdk.com/capacitor/mlcc/en/documents/mlcc_commercial_general_en.pdf; ComponentLink3URL: http://www.yuden.co.jp/or/product/category/capacitor/EMK107B7474KA-T.pdf; ComponentLink3Description: http://www.yuden.co.jp/or/product/category/capacitor/EMK107B7474KA-T.pdf
  C2 C3 C22 C53 C54 C57: Value: 0.1uF
  C9 C24 C55 C58: Value: 10uF
C26 C27 = CAP C_0805: Capacitor SMD Cer 1.8nF 10% 50V X7R 0805; Manufacturer 1: AVX Corporation; Manufacturer Part Number 1: 08055C182KAT2A; Ratings: 50V; X7R; SCDType: source*; Tolerance: ±10%; Operating Temperature: -55°C ~ 125°C; Package / Case: 0805 (2012 metric); Supplier 1: Digi-Key; Supplier Part Number 1: 478-1374-1-ND
C59-C61 = CAP C_0402: Capacitor SMD Cer 1nF 10% 16V X7R 0402; Manufacturer 1: AVX Corporation; Manufacturer Part Number 1: 0402YC102KAT2A; Ratings: 16V; X7R; SCDType: spec; Tolerance: ±10%; Operating Temperature: -55°C ~ 125°C; Package / Case: 0402 (1005 Metric); Size / Dimension: 0.039" L x 0.020" W (1.00mm x 0.50mm); Manufacturer 2: Yageo; Manufacturer Part Number 2: CC0402KRX7R7BB102; Supplier 1: Digi-Key; Supplier Part Number 1: 478-6197-1-ND; ComponentLink1URL: http://www.avx.com/docs/Catalogs/cx7r.pdf; ComponentLink1Description: http://www.avx.com/docs/Catalogs/cx7r.pdf; Supplier 2: Digi-Key; Supplier Part Number 2: 311-1352-1-ND; ComponentLink2URL: http://www.yageo.com/documents/recent/UPY-GPHC_X7R_6.3V-to-50V_8.pdf; ComponentLink2Description: http://www.yageo.com/documents/recent/UPY-GPHC_X7R_6.3V-to-50V_8.pdf; Value: 0.1uF
D1 D3 = PMEG2005EGWX: Schottky Diodes & Rectifiers SCHOTTKY DIODE; Manufacturer_Name: Nexperia; Geometry.Height: 1.3mm; Mouser Part Number: 841-PMEG2005EGWX; Mouser Price/Stock: https://www.mouser.co.uk/ProductDetail/Nexperia/PMEG2005EGWX?qs=EO%252B2iqeaG002IDp7lV8MpA%3D%3D; Manufacturer_Part_Number: PMEG2005EGWX; Datasheet Link: https://assets.nexperia.com/documents/data-sheet/PMEG2005EGW.pdf
D2 D6 = RESD1CANYT116: 44V Clamp 8A (8/20s) Ipp Tvs Diode Surface Mount SOT-23; Manufacturer_Name: ROHM Semiconductor; Geometry.Height: 1.15mm; Mouser Part Number: 755-RESD1CANYT116; Mouser Price/Stock: https://www.mouser.co.uk/ProductDetail/ROHM-Semiconductor/RESD1CANYT116?qs=QNEnbhJQKvYriPM%2Fif65Fw%3D%3D; Manufacturer_Part_Number: RESD1CANYT116; Datasheet Link: https://fscdn.rohm.com/en/products/databook/datasheet/discrete/diode/zener/resd1canyt116-e.pdf
D4 = PRTR5V0U2X_215: ESD Protection Diodes 5.5V Dual SOT143B NXP PRTR5V0U2X,215 Dual Uni-Directional TVS Diode, 4-Pin SOT-143B; Manufacturer_Name: Nexperia; Geometry.Height: 1.1mm; Mouser Part Number: 771-PRTR5V0U2X-T/R; Mouser Price/Stock: https://www.mouser.co.uk/ProductDetail/Nexperia/PRTR5V0U2X215?qs=LOCUfHb8d9sDkgY4cRj8Lw%3D%3D; Manufacturer_Part_Number: PRTR5V0U2X,215; Datasheet Link: https://assets.nexperia.com/documents/data-sheet/PRTR5V0U2X.pdf
D5 = TVS3V3L4U_E6327: Infineon TVS3V3L4U E6327 Uni-Directional TVS Diode, 6-Pin SC-74; Geometry.Height: 1.1mm; Mouser Part Number: 726-TVS3V3L4UE6327; Mouser Price/Stock: https://www.mouser.co.uk/ProductDetail/Infineon-Technologies/TVS3V3L4U-E6327?qs=TI%2F9gtmDCEGtLRKGd2tf3A%3D%3D; Manufacturer_Name: Infineon; Manufacturer_Part_Number: TVS3V3L4U E6327; Datasheet Link: *
FB1 FB2 = Ferrite Beads
J1 = ARJE-0034: 1 Port RJ45 Magjack Connector Surface Mount 10/100 Base-T, AutoMDIX; MF: Abracon LLC; SnapEDA_Link: https://www.snapeda.com/parts/ARJE-0034/Abracon+LLC/view-part/?ref=snap; Package: None; MP: ARJE-0034; Check_prices: https://www.snapeda.com/parts/ARJE-0034/Abracon+LLC/view-part/?ref=eda; Purchase-URL: https://pricing.snapeda.com/search/part/ARJE-0034/?ref=eda; Price: None; Value: *; Availability: In Stock
J2 = USB-5: Manufacturer: FCI; Manufacturer Part Number: 10118193-0001LF; Connector Type: USB - micro B; Number of Contacts: 5; Gender: Receptacle; Specifications: USB 2.0; .Creator: MM; .Checked PCB: RF; Supplier 1: Digi-Key; RoHS: RoHS Compliant; Category: Connectors, Interconnects; Stock 1: 28642; Pricing 1: 1=0.46, 10=0.433, 25=0.3712, 50=0.3156, 100=0.3032, 250=0.27224, 500=0.25988 (USD); Packaging: Cut Tape (CT); Mounting Type: Surface Mount, Right Angle, Horizontal; Features: Shielded, Solder Retention; Ingress Protection: -; ComponentLink1URL: http://portal.fciconnect.com/Comergent//fci/drawing/10118193.pdf; ComponentLink1Description: http://portal.fciconnect.com/Comergent//fci/drawing/10118193.pdf; Supplier Part Number 1: 609-4616-1-ND; .Checked SCH: MM
J3-J6 = JP3: Value: J3
J7 J8 = JP3: Jumper 3; Value: J3
J9 = JP3x2: Value: Connector 3x2
JP1 = JP 2x4 2.54 Cai Cong: Cắm; Ten_Linh_Kien: Jump Đôi Cái 2.54MM 2x40P Cong; Don_Vi: Con; Ma_Hang: MH001274; Ghi_Chu: *; Kieu_Chan: *; Chung_Loai: Cắm
JP2-JP4 = JP 2x10 2.54 Cai Cong: Cắm; Ten_Linh_Kien: Jump Đôi Cái 2.54MM 2x40P Cong; Don_Vi: Con; Ma_Hang: MH001274; Ghi_Chu: *; Kieu_Chan: *; Chung_Loai: Cắm
JP5 = JP 1x7 2.54 Cai Cong: Cắm; Ten_Linh_Kien: Jump Đơn Cái 2.54MM 1x40P Cong; Don_Vi: Con; Ma_Hang: MH001265; Ghi_Chu: *; Kieu_Chan: *; Chung_Loai: Cắm
JP6 = JP 1x5 2.54 Cai Cong: Cắm; Ten_Linh_Kien: Jump Đơn Cái 2.54MM 1x40P Cong; Don_Vi: Con; Ma_Hang: MH001265; Ghi_Chu: *; Kieu_Chan: *; Chung_Loai: Cắm
LED1-LED3 LED5-LED7 = LED SMD 0805
LED4 = LED RGB 5050: Manufacturer: Würth Elektronik eiSos GmbH; Color: Red & Green & Blue; PartNo: 150141M173100; ComponentLink1Description: Manufacturer; ComponentLink1URL: http://www.we-online.de; Created by: Christin Otto; Created Date: June 2013; ComponentLink2Description: Datasheet; ComponentLink2URL: http://katalog.we-online.com/led/datasheet/150141M173100.pdf
O1 = OSC SMD5070: OSC For all Crystal 4pin.; Value: 4Mhz
ON/OFF1 = DCIN
Q1 = BSS138P_215: BSS138P,215 N-Channel MOSFET, 360 mA, 60 V, 3-Pin SOT-23 Nexperia; Geometry.Height: 1.1mm; Mouser Part Number: 771-BSS138P215; Mouser Price/Stock: https://www.mouser.co.uk/ProductDetail/Nexperia/BSS138P215?qs=A1cBxND5mHJyVAOcRahidg%3D%3D; Manufacturer_Name: Nexperia; Manufacturer_Part_Number: BSS138P,215; Datasheet Link: https://assets.nexperia.com/documents/data-sheet/BSS138P.pdf
R1-R5 R7 R12 R16 R17 R19-R25 R27 R33-R45 R47 R49-R51 = RES_NL_0603: Resistor, SMD chip; Package / Case: 0603 (1608 metric)
R6 R8-R11 R13-R15 R18 R26 R28-R32 R46 R48 = RES_0402: Resistor SMD chip 1k Ohm 0.063W 5% 0402; Manufacturer 1: Yageo; Manufacturer Part Number 1: RC0402JR-071KL; Ratings: 1/16 W; SCDType: spec; Package / Case: 0402 (1005 Metric); Tolerance: ±5%; Supplier 1: Digi-Key; Supplier Part Number 1: 311-1.0KJRCT-ND; RoHS 1: RoHS Compliant; ComponentLink1URL: http://www.yageo.com/documents/recent/PYu-RC0402_51_RoHS_L_6.pdf; ComponentLink1Description: http://www.yageo.com/documents/recent/PYu-RC0402_51_RoHS_L_6.pdf; Supplier 2: Digi-Key; Supplier Part Number 2: 541-1.0KJCT-ND; Manufacturer 2: Vishay Dale; Manufacturer Part Number 2: CRCW04021K00JNED; RoHS 2: RoHS Compliant; ComponentLink2URL: http://www.vishay.com/doc?20035; ComponentLink2Description: http://www.vishay.com/doc?20035; Supplier 3: Digi-Key; Supplier Part Number 3: 1276-4376-1-ND; Manufacturer 3: Samsung Electro-Mechanics America, Inc; Manufacturer Part Number 3: RC1005J102CS; RoHS 3: RoHS Compliant; ComponentLink3URL: http://www.samsungsem.com/servlet/FileDownload?filename=productcatalog/pdf/Chip_Resistor.pdf; ComponentLink3Description: http://www.samsungsem.com/servlet/FileDownload?filename=productcatalog/pdf/Chip_Resistor.pdf; Supplier 4: Digi-Key; Supplier Part Number 4: RHM1.0KCECT-ND; Manufacturer 4: Rohm Semiconductor; Manufacturer Part Number 4: MCR01MRTJ102; RoHS 4: RoHS Compliant; ComponentLink4URL: http://rohmfs.rohm.com/en/products/databook/datasheet/passive/resistor/chip_resistor/mcr_g.pdf; ComponentLink4Description: http://rohmfs.rohm.com/en/products/databook/datasheet/passive/resistor/chip_resistor/mcr_g.pdf; Supplier 5: Digi-Key; Supplier Part Number 5: P1.0KJCT-ND; Manufacturer 5: Panasonic Electronic Components; Manufacturer Part Number 5: ERJ-2GEJ102X; RoHS 5: RoHS Compliant; ComponentLink5URL: http://industrial.panasonic.com/www-cgi/jvcr13pz.cgi?E+PZ+3+AOA0001+ERJ2GEJ102X+7+WW; ComponentLink5Description: http://industrial.panasonic.com/www-cgi/jvcr13pz.cgi?E+PZ+3+AOA0001+ERJ2GEJ102X+7+WW
SW1 = SW2: Switch button 2 pin; Value: SW chip 2 pin
SW2-SW6 = SW4: Switch button 4 pin; Value: Button chip 4 pin
X1 X2 = XT3: Crystal For all Crystal 2pin.; Value: 4Mhz